# EAGLE design sid-guts-dx-rev005 (EAGLE 7.7.0)

## Sheet 1 of 3
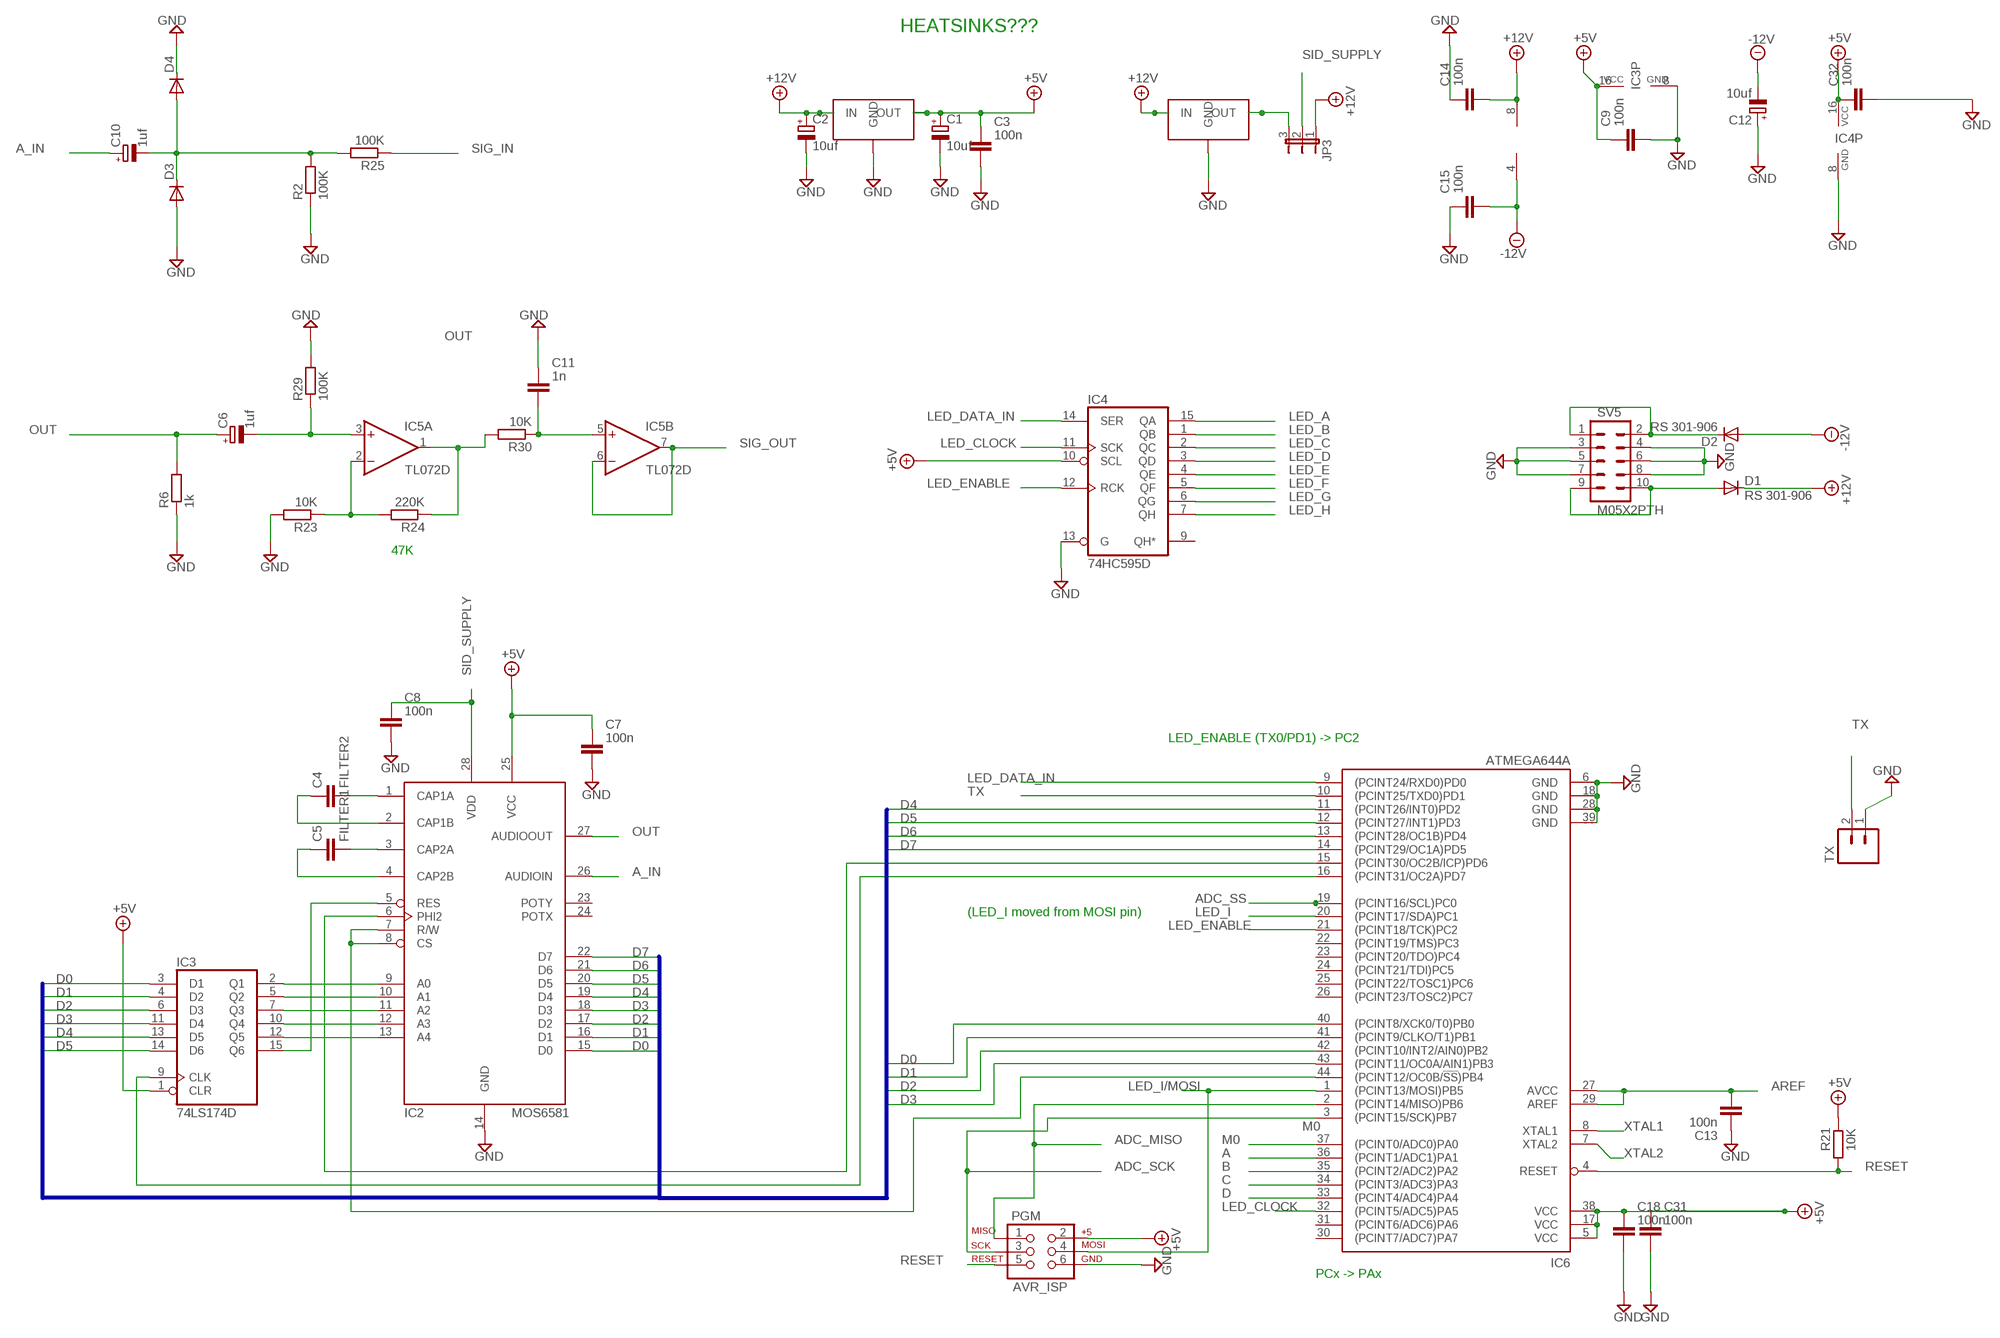
[diagram p0: schematic, sheet 1, part 1 of 2]
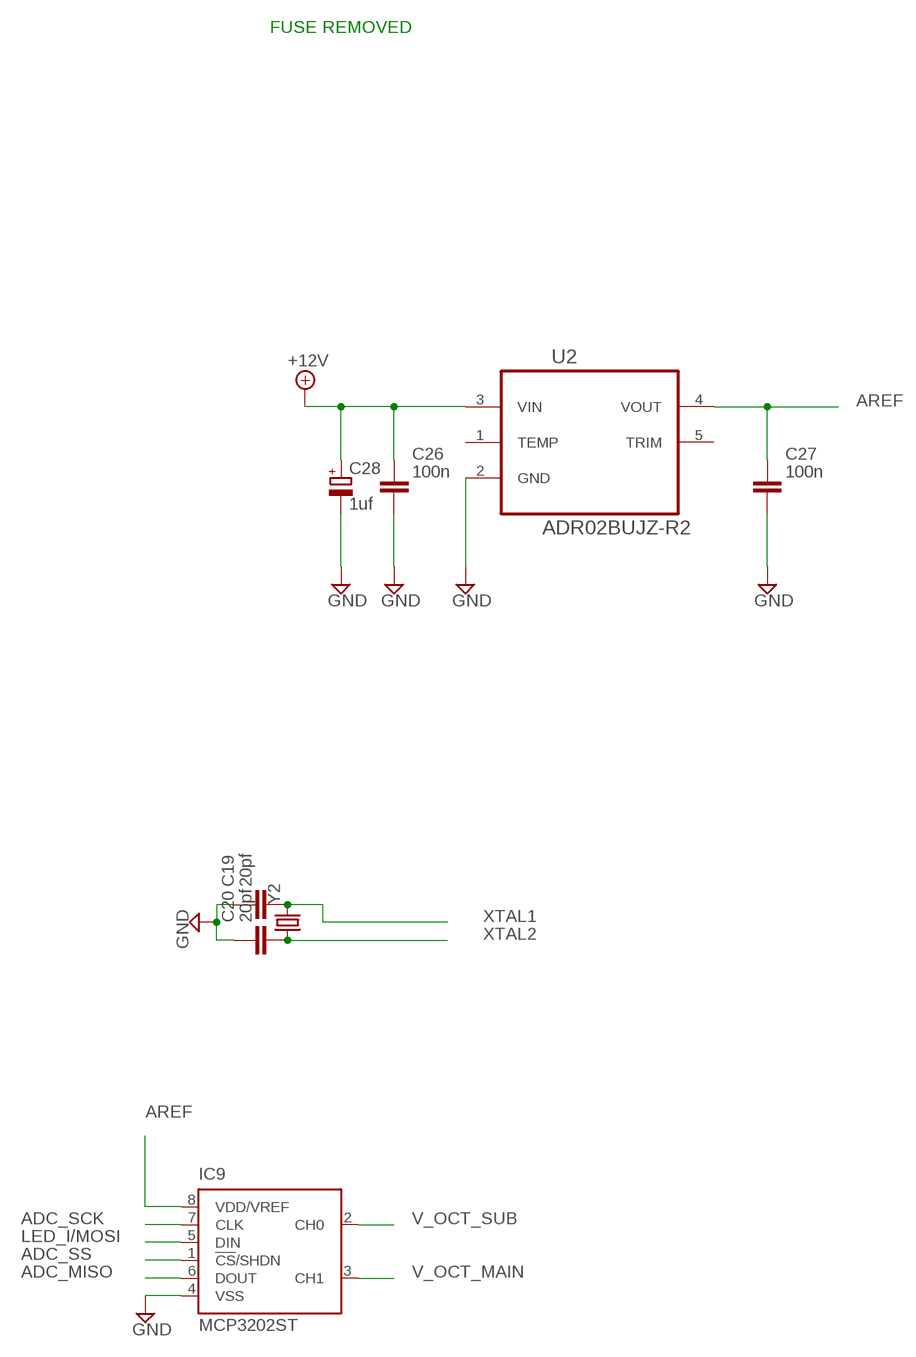
[diagram p1: schematic, sheet 1, part 2 of 2]

### Parts
C1  10uf  CPOL-EUB  [PANASONIC_B]
C2  10uf  CPOL-EUB  [PANASONIC_B]
C3  100n  CAPACITOR0603  [C0603]
C4  FILTER2  C-EU050-025X075  [C050-025X075]
C5  FILTER1  C-EU050-025X075  [C050-025X075]
C6  1uf  CPOL-EUB  [PANASONIC_B]
C7  100n  CAPACITOR0603  [C0603]
C8  100n  CAPACITOR0603  [C0603]
C9  100n  CAPACITOR0603  [C0603]
C10  1uf  CPOL-EUB  [PANASONIC_B]
C11  1n  CAPACITOR0603  [C0603]
C12  10uf  CPOL-EUB  [PANASONIC_B]
C13  100n  CAPACITOR0603  [C0603]
C14  100n  CAPACITOR0603  [C0603]
C15  100n  CAPACITOR0603  [C0603]
C18  100n  CAPACITOR0603  [C0603]
C19  20pf  CAPACITOR0603  [C0603]
C20  20pf  CAPACITOR0603  [C0603]
C26  100n  CAPACITOR0603  [C0603]
C27  100n  CAPACITOR0603  [C0603]
C28  1uf  CPOL-EUB  [PANASONIC_B]
C31  100n  CAPACITOR0603  [C0603]
C32  100n  CAPACITOR0603  [C0603]
D1  RS 301-906  DIODESMB  [SMB-DIODE]
D2  RS 301-906  DIODESMB  [SMB-DIODE]
D3  DIODE-SOD123  [SOD123]
D4  DIODE-SOD123  [SOD123]
IC2  MOS6581  [DIP-28]
IC3  74LS174D  [SO16]
IC4  74HC595D  [SO16]
IC5  TL072D  [SO08]
IC6  ATMEGA644A  [TQFP44]
IC9  MCP3202ST  [TSSOP8]
JP3  JP2E  [JP2]
PGM  AVR_ISP  AVR_SPI_PRG_6PTH  [2X3]
R2  100K  RESISTOR0603  [R0603]
R6  1k  RESISTOR0603  [R0603]
R21  10K  RESISTOR0603  [R0603]
R23  10K  RESISTOR0603  [R0603]
R24  220K  RESISTOR0603  [R0603]
R25  100K  RESISTOR0603  [R0603]
R29  100K  RESISTOR0603  [R0603]
R30  10K  RESISTOR0603  [R0603]
SV5  M05X2PTH  [AVR_ICSP]
TX  M02PTH  [1X02]
U2  ADR02BUJZ-R2  [SOT95P280X100-5N]
U3  7805  VREG-7805-DPAK2  [VREG-7805-DPAK2]
U4  7905  VREG-7805-DPAK2  [VREG-7805-DPAK2]
Y2  CRYSTALSMD  [HC49UP]

### Nets
+5V: C1.+ C3.1 C7.1 C9.1 C18.1 C31.1 C32.1 IC2.25(VCC) IC3.1(CLR) IC3.16(VCC) IC4.10(SCL) IC4.16(VCC) IC6.5(VCC) IC6.17(VCC) IC6.38(VCC) PGM.2 R21.2 U3.VOUT(OUT) ; also sheet 2,3
+12V: C2.+ C14.2 C26.1 C28.+ D1.C IC5.8(P:V+) JP3.1 U2.3(VIN) U3.VIN(IN) U4.VIN(IN) ; also sheet 2,3
-12V: C12.- C15.2 D2.A IC5.4(P:V-) ; also sheet 2,3
A: IC6.36((PCINT1/ADC1)PA1) ; also sheet 2
A_IN: C10.+ IC2.26(AUDIOIN)
ADC_MISO: IC6.2((PCINT14/MISO)PB6) IC9.6(DOUT) PGM.1
ADC_SCK: IC6.3((PCINT15/SCK)PB7) IC9.7(CLK) PGM.3
ADC_SS: IC6.19((PCINT16/SCL)PC0) IC9.1(!CS!/SHDN)
AREF: C13.2 C27.1 IC6.27(AVCC) IC6.29(AREF) IC9.8(VDD/VREF) U2.4(VOUT)
B: IC6.35((PCINT2/ADC2)PA2) ; also sheet 2
C: IC6.34((PCINT3/ADC3)PA3) ; also sheet 2
CS/RW: IC2.7(R/W) IC2.8(CS) IC6.44((PCINT12/OC0B/!SS!)PB4)
D: IC6.33((PCINT4/ADC4)PA4) ; also sheet 2
D0: IC2.15(D0) IC3.3(D1) IC6.40((PCINT8/XCK0/T0)PB0)
D1: IC2.16(D1) IC3.4(D2) IC6.41((PCINT9/CLKO/T1)PB1)
D2: IC2.17(D2) IC3.6(D3) IC6.42((PCINT10/INT2/AIN0)PB2)
D3: IC2.18(D3) IC3.11(D4) IC6.43((PCINT11/OC0A/AIN1)PB3)
D4: IC2.19(D4) IC3.13(D5) IC6.11((PCINT26/INT0)PD2)
D5: IC2.20(D5) IC3.14(D6) IC6.12((PCINT27/INT1)PD3)
D6: IC2.21(D6) IC6.13((PCINT28/OC1B)PD4)
D7: IC2.22(D7) IC6.14((PCINT29/OC1A)PD5)
GND: C1.- C2.- C3.2 C7.2 C8.2 C9.2 C11.1 C12.+ C13.1 C14.1 C15.1 C18.2 C19.1 C20.1 C26.2 C27.2 C28.- C31.2 C32.2 D3.A D4.C IC2.14(GND) IC3.8(GND) IC4.8(GND) IC4.13(G) IC6.6(GND) IC6.18(GND) IC6.28(GND) IC6.39(GND) IC9.4(VSS) PGM.6 R2.1 R6.1 R23.2 R29.2 SV5.3 SV5.4 SV5.5 SV5.6 SV5.7 SV5.8 TX.1 U2.2(GND) U3.GND U4.GND ; also sheet 2,3
LED_A: IC4.15(QA) ; also sheet 2
LED_B: IC4.1(QB) ; also sheet 2
LED_C: IC4.2(QC) ; also sheet 2
LED_CLOCK: IC4.11(SCK) IC6.32((PCINT5/ADC5)PA5)
LED_D: IC4.3(QD) ; also sheet 2
LED_DATA_IN: IC4.14(SER) IC6.9((PCINT24/RXD0)PD0)
LED_E: IC4.4(QE) ; also sheet 2
LED_ENABLE: IC4.12(RCK) IC6.21((PCINT18/TCK)PC2)
LED_F: IC4.5(QF) ; also sheet 2
LED_G: IC4.6(QG) ; also sheet 2
LED_H: IC4.7(QH) ; also sheet 2
LED_I: IC6.20((PCINT17/SDA)PC1) ; also sheet 2
LED_I/MOSI: IC6.1((PCINT13/MOSI)PB5) IC9.5(DIN) PGM.4
M0: IC6.37((PCINT0/ADC0)PA0) ; also sheet 2
N$1: D2.C SV5.1 SV5.2
N$2: JP3.3 U4.VOUT(OUT)
N$3: D1.A SV5.9 SV5.10
N$6: C4.2 IC2.1(CAP1A)
N$8: C4.1 IC2.2(CAP1B)
N$10: C5.2 IC2.3(CAP2A)
N$11: C5.1 IC2.4(CAP2B)
N$12: IC2.9(A0) IC3.2(Q1)
N$13: IC2.10(A1) IC3.5(Q2)
N$14: IC2.11(A2) IC3.7(Q3)
N$15: IC2.12(A3) IC3.10(Q4)
N$16: IC2.13(A4) IC3.12(Q5)
N$17: IC2.5(RES) IC3.15(Q6)
N$19: IC5.1(A:OUT) R24.1 R30.2
N$21: IC3.9(CLK) IC6.16((PCINT31/OC2A)PD7)
N$22: C6.- IC5.3(A:+IN) R29.1
N$23: IC5.2(A:-IN) R23.1 R24.2
N$24: IC2.6(PHI2) IC6.15((PCINT30/OC2B/ICP)PD6)
N$30: C10.- D3.C D4.A R2.2 R25.2
N$42: C11.2 IC5.5(B:+IN) R30.1
OUT: C6.+ IC2.27(AUDIOOUT) R6.2
RESET: IC6.4(RESET) PGM.5 R21.1
SID_SUPPLY: C8.1 IC2.28(VDD) JP3.2
SIG_IN: R25.1 ; also sheet 2
SIG_OUT: IC5.6(B:-IN) IC5.7(B:OUT) ; also sheet 2
TX: IC6.10((PCINT25/TXD0)PD1) TX.2
V_OCT_MAIN: IC9.3(CH1) ; also sheet 3
V_OCT_SUB: IC9.2(CH0) ; also sheet 3
XTAL1: C19.2 IC6.8(XTAL1) Y2.2
XTAL2: C20.2 IC6.7(XTAL2) Y2.1
Unconnected: IC2.23(POTY) IC2.24(POTX) IC4.9(QH*) IC6.22((PCINT19/TMS)PC3) IC6.23((PCINT20/TDO)PC4) IC6.24((PCINT21/TDI)PC5) IC6.25((PCINT22/TOSC1)PC6) IC6.26((PCINT23/TOSC2)PC7) IC6.30((PCINT7/ADC7)PA7) IC6.31((PCINT6/ADC6)PA6) U2.1(TEMP) U2.5(TRIM)

### Buses
D[0..7]

### Notes on the sheet
- HEATSINKS???
- FUSE REMOVED
- 47K
- LED_ENABLE (TX0/PD1) -> PC2
- (LED_I moved from MOSI pin)
- PCx -> PAx

## Sheet 2 of 3
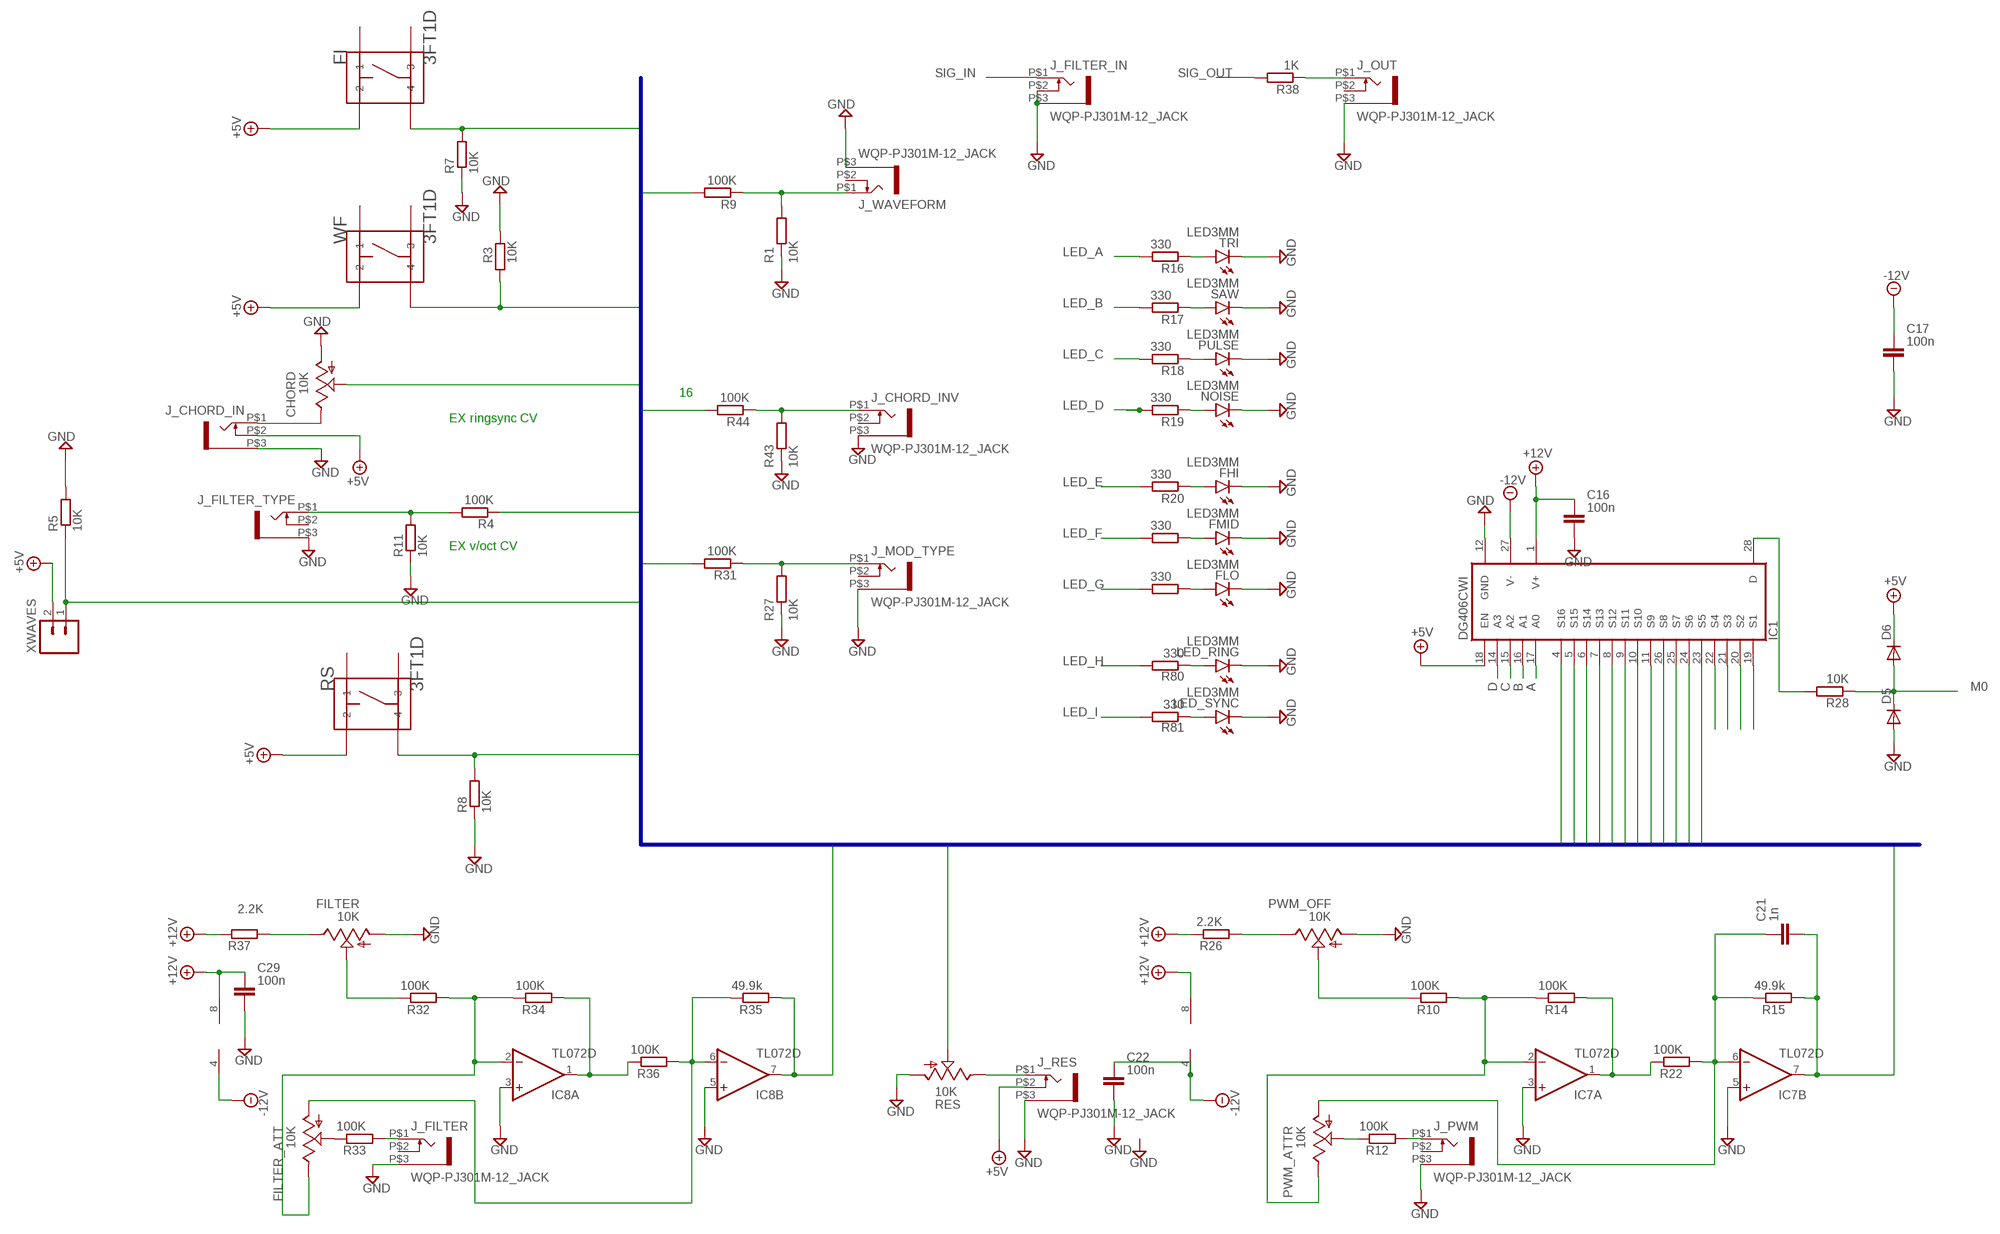
[diagram p2: schematic, sheet 2]

### Parts
C16  100n  CAPACITOR0603  [C0603]
C17  100n  CAPACITOR0603  [C0603]
C21  1n  CAPACITOR0603  [C0603]
C22  100n  CAPACITOR0603  [C0603]
C29  100n  CAPACITOR0603  [C0603]
CHORD  10K  ALPHA-9MMA  [EVUF]
D5  DIODE-SOD123  [SOD123]
D6  DIODE-SOD123  [SOD123]
FHI  LED3MM  [LED3MM]
FI  3FT1D  [3FT]
FILTER  10K  ALPHA-9MMA  [EVUF]
FILTER_ATT  10K  ALPHA-9MMA  [EVUF]
FLO  LED3MM  [LED3MM]
FMID  LED3MM  [LED3MM]
IC1  DG406CWI  [SO28L]
IC7  TL072D  [SO08]
IC8  TL072D  [SO08]
J_CHORD_IN  WQP-PJ301M-12_JACK  [WQP-PJ301M-12_JACK]
J_CHORD_INV  WQP-PJ301M-12_JACK  [WQP-PJ301M-12_JACK]
J_FILTER  WQP-PJ301M-12_JACK  [WQP-PJ301M-12_JACK]
J_FILTER_IN  WQP-PJ301M-12_JACK  [WQP-PJ301M-12_JACK]
J_FILTER_TYPE  WQP-PJ301M-12_JACK  [WQP-PJ301M-12_JACK]
J_MOD_TYPE  WQP-PJ301M-12_JACK  [WQP-PJ301M-12_JACK]
J_OUT  WQP-PJ301M-12_JACK  [WQP-PJ301M-12_JACK]
J_PWM  WQP-PJ301M-12_JACK  [WQP-PJ301M-12_JACK]
J_RES  WQP-PJ301M-12_JACK  [WQP-PJ301M-12_JACK]
J_WAVEFORM  WQP-PJ301M-12_JACK  [WQP-PJ301M-12_JACK]
LED_RING  LED3MM  [LED3MM]
LED_SYNC  LED3MM  [LED3MM]
NOISE  LED3MM  [LED3MM]
PULSE  LED3MM  [LED3MM]
PWM_ATTR  10K  ALPHA-9MMA  [EVUF]
PWM_OFF  10K  ALPHA-9MMA  [EVUF]
R1  10K  RESISTOR0603  [R0603]
R3  10K  RESISTOR0603  [R0603]
R4  100K  RESISTOR0603  [R0603]
R5  10K  RESISTOR0603  [R0603]
R7  10K  RESISTOR0603  [R0603]
R8  10K  RESISTOR0603  [R0603]
R9  100K  RESISTOR0603  [R0603]
R10  100K  RESISTOR0603  [R0603]
R11  10K  RESISTOR0603  [R0603]
R12  100K  RESISTOR0603  [R0603]
R14  100K  RESISTOR0603  [R0603]
R15  49.9k  RESISTOR0603  [R0603]
R16  330  RESISTOR0603  [R0603]
R17  330  RESISTOR0603  [R0603]
R18  330  RESISTOR0603  [R0603]
R19  330  RESISTOR0603  [R0603]
R20  330  RESISTOR0603  [R0603]
R22  100K  RESISTOR0603  [R0603]
R26  2.2K  RESISTOR0603  [R0603]
R27  10K  RESISTOR0603  [R0603]
R28  10K  RESISTOR0603  [R0603]
R31  100K  RESISTOR0603  [R0603]
R32  100K  RESISTOR0603  [R0603]
R33  100K  RESISTOR0603  [R0603]
R34  100K  RESISTOR0603  [R0603]
R35  49.9k  RESISTOR0603  [R0603]
R36  100K  RESISTOR0603  [R0603]
R37  2.2K  RESISTOR0603  [R0603]
R38  1K  RESISTOR0603  [R0603]
R43  10K  RESISTOR0603  [R0603]
R44  100K  RESISTOR0603  [R0603]
R80  330  RESISTOR0603  [R0603]
R81  330  RESISTOR0603  [R0603]
R82  330  RESISTOR0603  [R0603]
R83  330  RESISTOR0603  [R0603]
RES  10K  ALPHA-9MMA  [EVUF]
RS  3FT1D  [3FT]
SAW  LED3MM  [LED3MM]
TRI  LED3MM  [LED3MM]
WF  3FT1D  [3FT]
XWAVES  M02PTH  [1X02]

### Nets
+5V: D6.C FI.P$2 IC1.18(EN) J_CHORD_IN.P$2 J_RES.P$2 RS.P$2 WF.P$2 XWAVES.2 ; also sheet 1,3
+12V: C16.1 C29.1 IC1.1(V+) IC7.8(P:V+) IC8.8(P:V+) R26.2 R37.2 ; also sheet 1,3
-12V: C17.1 C22.1 IC1.27(V-) IC7.4(P:V-) IC8.4(P:V-) ; also sheet 1,3
A: IC1.17(A0) ; also sheet 1
B: IC1.16(A1) ; also sheet 1
C: IC1.15(A2) ; also sheet 1
D: IC1.14(A3) ; also sheet 1
EXP1: IC1.22(S4)
EXP3: IC1.20(S2)
EXP5: IC1.21(S3)
EXP6: IC1.19(S1)
GND: C16.2 C17.2 C22.2 C29.2 CHORD.1(A) D5.A FHI.K(C) FILTER.1(A) FLO.K(C) FMID.K(C) IC1.12(GND) IC7.3(A:+IN) IC7.5(B:+IN) IC8.3(A:+IN) IC8.5(B:+IN) J_CHORD_IN.P$3 J_CHORD_INV.P$3 J_FILTER.P$3 J_FILTER_IN.P$2 J_FILTER_IN.P$3 J_FILTER_TYPE.P$3 J_MOD_TYPE.P$3 J_OUT.P$3 J_PWM.P$3 J_RES.P$3 J_WAVEFORM.P$3 LED_RING.K(C) LED_SYNC.K(C) NOISE.K(C) PULSE.K(C) PWM_OFF.1(A) R1.1 R3.2 R5.2 R7.1 R8.1 R11.1 R27.1 R43.1 RES.1(A) SAW.K(C) TRI.K(C) ; also sheet 1,3
I5: C21.2 IC1.23(S5) IC7.7(B:OUT) R15.1
I6: IC1.24(S6) RES.2(S)
I7: IC1.25(S7) IC8.7(B:OUT) R35.1
I8: FI.P$4 IC1.26(S8) R7.2
I9: IC1.11(S9) R5.1 XWAVES.1
I10: IC1.10(S10) R8.2 RS.P$4
I11: IC1.9(S11) R4.1
I12: CHORD.2(S) IC1.8(S12)
I13: IC1.7(S13) R9.2
I14: IC1.6(S14) R3.1 WF.P$4
I15: IC1.5(S15) R31.2
I16: IC1.4(S16) R44.2
LED_A: R16.2 ; also sheet 1
LED_B: R17.2 ; also sheet 1
LED_C: R18.2 ; also sheet 1
LED_D: R19.2 ; also sheet 1
LED_E: R20.2 ; also sheet 1
LED_F: R83.2 ; also sheet 1
LED_G: R82.2 ; also sheet 1
LED_H: R80.2 ; also sheet 1
LED_I: R81.2 ; also sheet 1
M0: D5.C D6.A R28.1 ; also sheet 1
N$18: FHI.A R20.1
N$20: CHORD.3(E) J_CHORD_IN.P$1
N$25: FMID.A R83.1
N$26: FLO.A R82.1
N$27: IC1.28(D) R28.2
N$28: J_WAVEFORM.P$1 R1.2 R9.1
N$29: LED_RING.A R80.1
N$31: LED_SYNC.A R81.1
N$33: J_FILTER_TYPE.P$1 R4.2 R11.2
N$34: J_RES.P$1 RES.3(E)
N$35: PWM_OFF.2(S) R10.2
N$36: IC7.2(A:-IN) PWM_ATTR.3(E) R10.1 R14.2
N$37: R16.1 TRI.A
N$38: R17.1 SAW.A
N$39: PULSE.A R18.1
N$40: NOISE.A R19.1
N$41: J_PWM.P$1 R12.1
N$43: PWM_ATTR.2(S) R12.2
N$44: IC7.1(A:OUT) R14.1 R22.2
N$45: C21.1 IC7.6(B:-IN) PWM_ATTR.1(A) R15.2 R22.1
N$46: PWM_OFF.3(E) R26.1
N$47: J_MOD_TYPE.P$1 R27.2 R31.1
N$48: FILTER.2(S) R32.2
N$49: FILTER_ATT.3(E) IC8.2(A:-IN) R32.1 R34.2
N$50: J_FILTER.P$1 R33.1
N$51: IC8.1(A:OUT) R34.1 R36.2
N$52: FILTER_ATT.1(A) IC8.6(B:-IN) R35.2 R36.1
N$53: FILTER.3(E) R37.1
N$54: J_OUT.P$1 R38.1
N$55: FILTER_ATT.2(S) R33.2
N$60: J_CHORD_INV.P$1 R43.2 R44.1
SIG_IN: J_FILTER_IN.P$1 ; also sheet 1
SIG_OUT: R38.2 ; also sheet 1
Unconnected: FI.P$1 FI.P$3 J_CHORD_INV.P$2 J_FILTER.P$2 J_FILTER_TYPE.P$2 J_MOD_TYPE.P$2 J_OUT.P$2 J_PWM.P$2 J_WAVEFORM.P$2 RS.P$1 RS.P$3 WF.P$1 WF.P$3

### Buses
I[1..16]

### Notes on the sheet
- 16
- EX ringsync CV
- EX v/oct CV

## Sheet 3 of 3
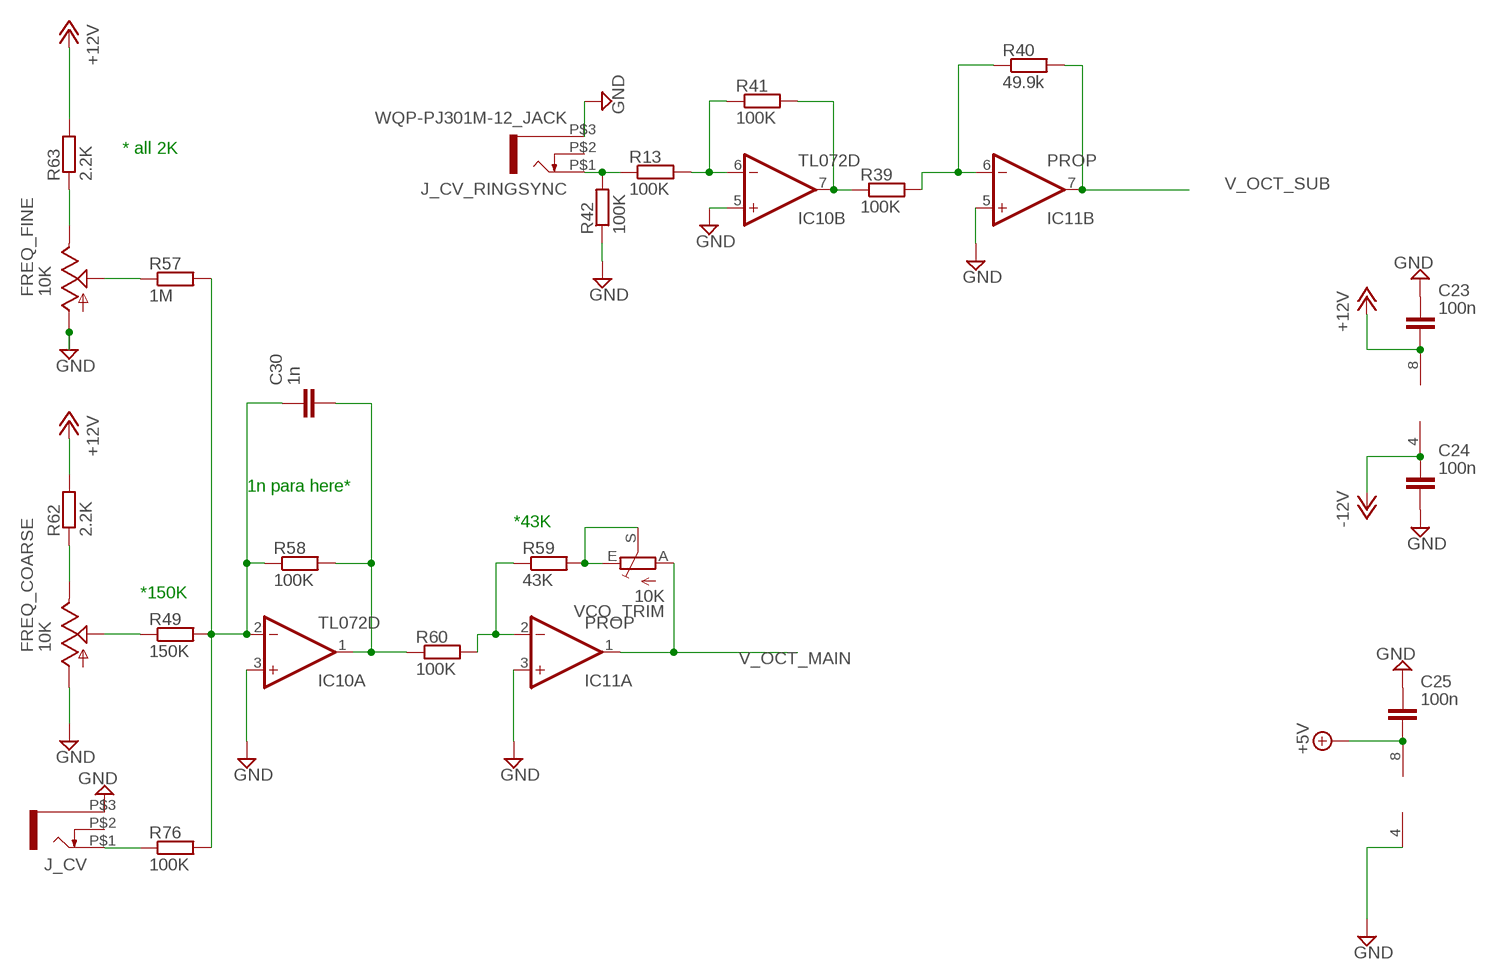
[diagram p3: schematic, sheet 3]

### Parts
C23  100n  CAPACITOR0603  [C0603]
C24  100n  CAPACITOR0603  [C0603]
C25  100n  CAPACITOR0603  [C0603]
C30  1n  CAPACITOR0603  [C0603]
FREQ_COARSE  10K  ALPHA-9MMA  [EVUF]
FREQ_FINE  10K  ALPHA-9MMA  [EVUF]
IC10  TL072D  [SO08]
IC11  PROP  TL072D  [SO08]
J_CV  WQP-PJ301M-12_JACK  [WQP-PJ301M-12_JACK]
J_CV_RINGSYNC  WQP-PJ301M-12_JACK  [WQP-PJ301M-12_JACK]
R13  100K  RESISTOR0603  [R0603]
R39  100K  RESISTOR0603  [R0603]
R40  49.9k  RESISTOR0603  [R0603]
R41  100K  RESISTOR0603  [R0603]
R42  100K  RESISTOR0603  [R0603]
R49  150K  RESISTOR0603  [R0603]
R57  1M  RESISTOR0603  [R0603]
R58  100K  RESISTOR0603  [R0603]
R59  43K  RESISTOR0603  [R0603]
R60  100K  RESISTOR0603  [R0603]
R62  2.2K  RESISTOR0603  [R0603]
R63  2.2K  RESISTOR0603  [R0603]
R76  100K  RESISTOR0603  [R0603]
VCO_TRIM  10K  TRIM_1234-S64YW  [S64YW]

### Nets
+5V: C25.2 IC11.8(P:V+) ; also sheet 1,2
+12V: C23.2 IC10.8(P:V+) R62.2 R63.2 ; also sheet 1,2
-12V: C24.1 IC10.4(P:V-) ; also sheet 1,2
GND: C23.1 C24.2 C25.1 FREQ_COARSE.1(A) FREQ_FINE.1(A) IC10.3(A:+IN) IC10.5(B:+IN) IC11.3(A:+IN) IC11.4(P:V-) IC11.5(B:+IN) J_CV.P$3 J_CV_RINGSYNC.P$3 R42.1 ; also sheet 1,2
N$4: IC10.7(B:OUT) R39.1 R41.2
N$5: IC10.6(B:-IN) R13.2 R41.1
N$7: J_CV_RINGSYNC.P$1 R13.1 R42.2
N$9: IC11.6(B:-IN) R39.2 R40.1
N$32: J_CV.P$1 R76.1
N$79: FREQ_COARSE.2(S) R49.1
N$80: C30.1 IC10.2(A:-IN) R49.2 R57.2 R58.1 R76.2
N$82: FREQ_FINE.2(S) R57.1
N$83: C30.2 IC10.1(A:OUT) R58.2 R60.1
N$84: IC11.2(A:-IN) R59.1 R60.2
N$85: R59.2 VCO_TRIM.E VCO_TRIM.S
N$87: FREQ_COARSE.3(E) R62.1
N$88: FREQ_FINE.3(E) R63.1
V_OCT_MAIN: IC11.1(A:OUT) VCO_TRIM.A ; also sheet 1
V_OCT_SUB: IC11.7(B:OUT) R40.2 ; also sheet 1
Unconnected: J_CV.P$2 J_CV_RINGSYNC.P$2 VCO_TRIM.S@1(S)

### Notes on the sheet
- * all 2K
- 1n para here*
- *43K
- *150K

## Library data of the parts
C1 C2 C6 C10 C12 C28 = rcl:CPOL-EU: POLARIZED CAPACITOR, European symbol
C3 C7-C9 C11 C13-C27 C29-C32 = allum_extras:CAPACITOR
C4 C5 = rcl:C-EU: CAPACITOR, European symbol
CHORD FILTER FILTER_ATT FREQ_COARSE FREQ_FINE PWM_ATTR PWM_OFF RES = TomW:ALPHA-9MM: 9 mm Square Rotary Potentiometers Source: Panasonic
D1 D2 = SparkFun:DIODE: Diode These are standard reverse protection diodes and small signal diodes. SMA package can handle up to about 1A. SOD-323 can handle about 200mA. What the SOD-323 package when ordering, there are some mfgs out there that are 5-pin packages.
D3-D6 = diode:DIODE-: DIODE
FHI FLO FMID LED_RING LED_SYNC NOISE PULSE SAW TRI = allum_extras:LED
FI RS WF = mec switches:3FT1D: Mulitmec - 3FT1D <http://www.mec.dk/statisk.php4?id=504> Switch 3F - Through Hole with basic matt cover http://www.mec.dk
IC1 = maxim:DG406CWI: ANALOG MULTIPLEXER; MF: MAXIM; MPN: DG406CWI; OC_FARNELL: unknown; OC_NEWARK: 77C6458
IC2 = 65xxx:MOS6581
IC3 = 74xx-eu:74*174: Hex D type FLIP FLOP, clear
IC4 = 74xx-eu:74*595: 8-bit SHIFT REGISTER, output latch
IC5 IC7 IC8 = TomW:TL072: OP AMP
IC6 = atmel:ATMEGA644: 8-bit Microcontroller with 64K Bytes In-System Programmable Flash Source: http://www.atmel.com/dyn/resources/prod_documents/doc2593.pdf; MPN: ATMEGA644PV-10AU; OC_FARNELL: 1455123; OC_NEWARK: 58M3748
IC9 = microchip:MCP3202: 2.7V Dual Channel 12-Bit A/D Converter with SPI Serial Interface Source: http://ww1.microchip.com/downloads/en/DeviceDoc/21034D.pdf; MF: MICROCHIP; MPN: MCP3202-CI/ST; OC_FARNELL: unknown; OC_NEWARK: 59K0226
IC10 IC11 = linear:TL072: OP AMP
J_CHORD_IN J_CHORD_INV J_CV J_CV_RINGSYNC J_FILTER J_FILTER_IN J_FILTER_TYPE J_MOD_TYPE J_OUT J_PWM J_RES J_WAVEFORM = allum_extras:WQP-PJ301M-12_JACK
JP3 = allum_extras:JP2E: JUMPER
PGM = SparkFun:AVR_SPI_PRG_6: AVR ISP 6 Pin This is the reduced ISP connector for AVR programming. Common on Arduino. This footprint will take up less PCB space and can be used with a 10-pin to 6-pin adapter such as SKU: BOB-08508
R1-R44 R49 R57-R60 R62 R63 R76 R80-R83 = allum_extras:RESISTOR
SV5 = SparkFun:M05X2: Header 5x2 Standard 10-pin dual row 0.1" header. Commonly used with AVR-ISP. Use with Spark Fun Electronics SKU: PRT-00778
TX XWAVES = SparkFun:M02: Header 2 Standard 2-pin 0.1" header. Use with straight break away headers (SKU : PRT-00116), right angle break away headers (PRT-00553), swiss pins (PRT-00743), machine pins (PRT-00117), and female headers (PRT-00115). Molex polarized connector foot print use with SKU : PRT-08233 with associated crimp pins and housings.
U2 = allum_extras:ADR02BUJZ-R2: Ultracompact, Precision 10.0 V/5.0 V/2.5 V/3.0 V Voltage References; MPN: ADR02BUJZ-R2; OC_FARNELL: 1699545; OC_NEWARK: 28M3867; PACKAGE: TSOT-5; SUPPLIER: Analog Devices
U3 U4 = vreg-7805-dpak2:VREG-7805-DPAK2
VCO_TRIM = pot:TRIM_1234-: POTENTIOMETER
Y2 = SparkFun:CRYSTAL: Crystals Various standard crystals. Proven footprints. Spark Fun Electronics SKU : COM-00534

## Board
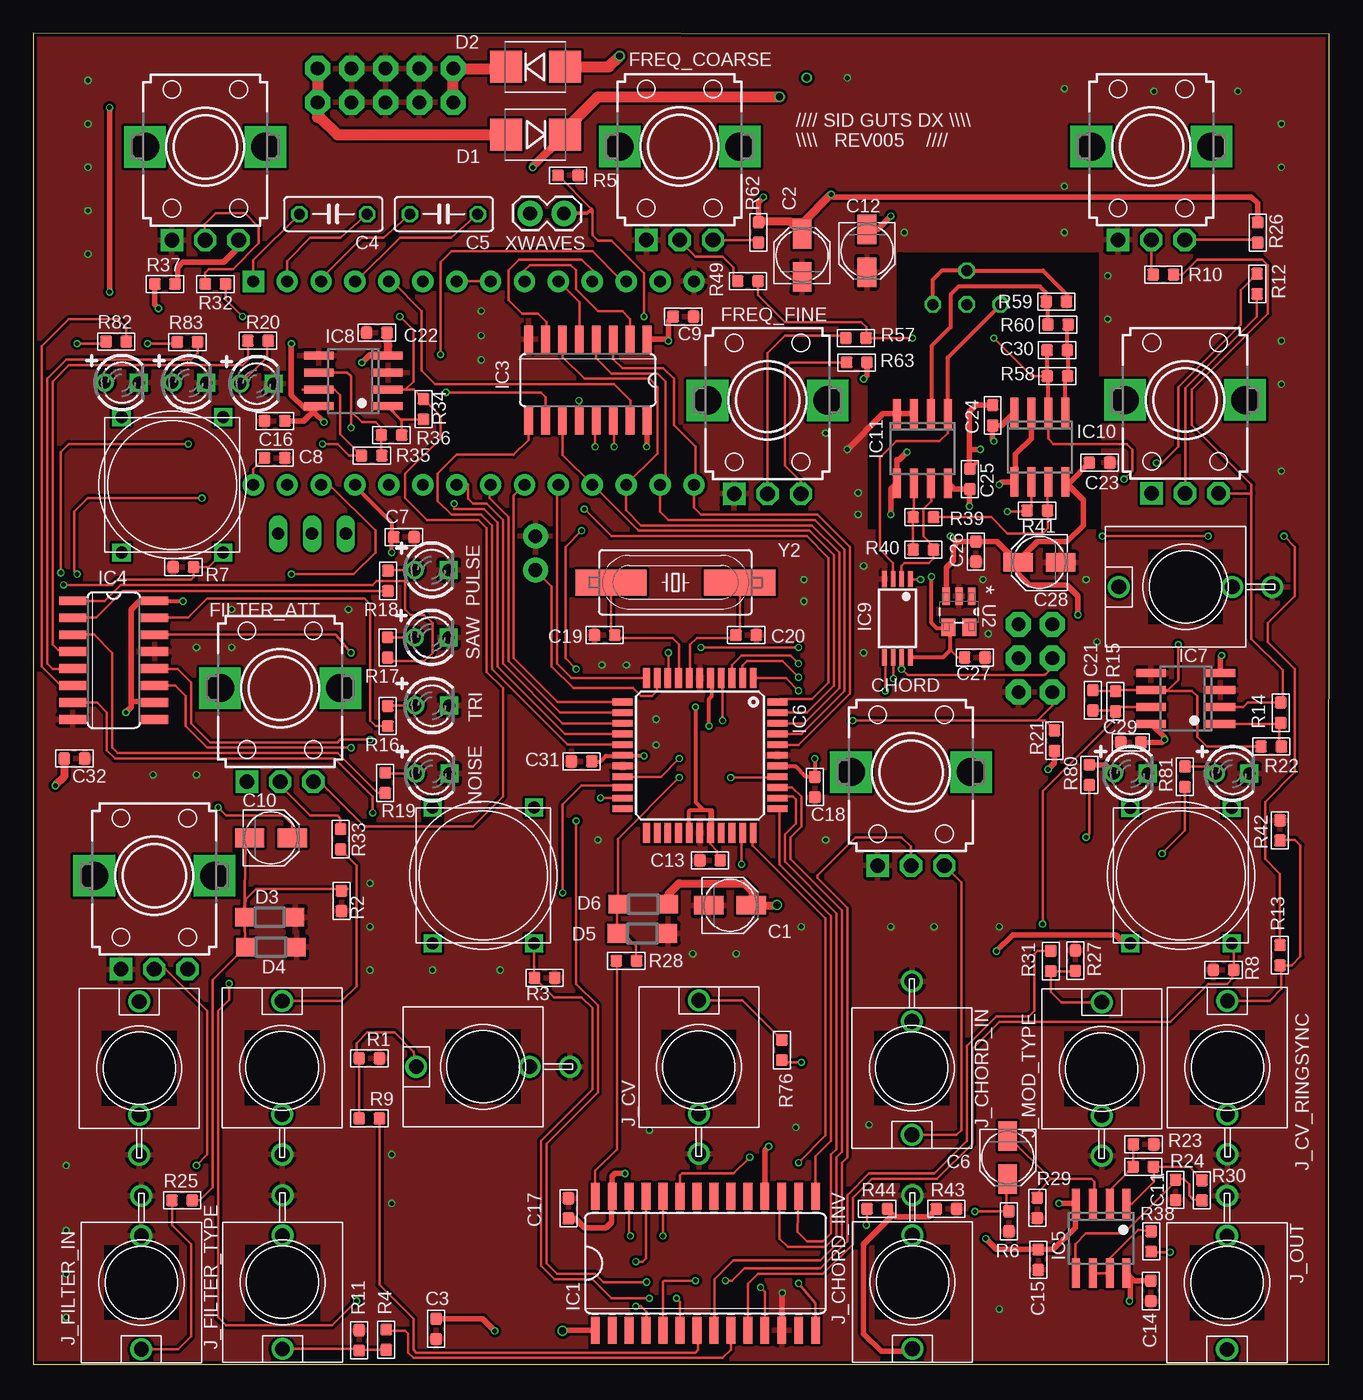
[diagram p4: board, top side]
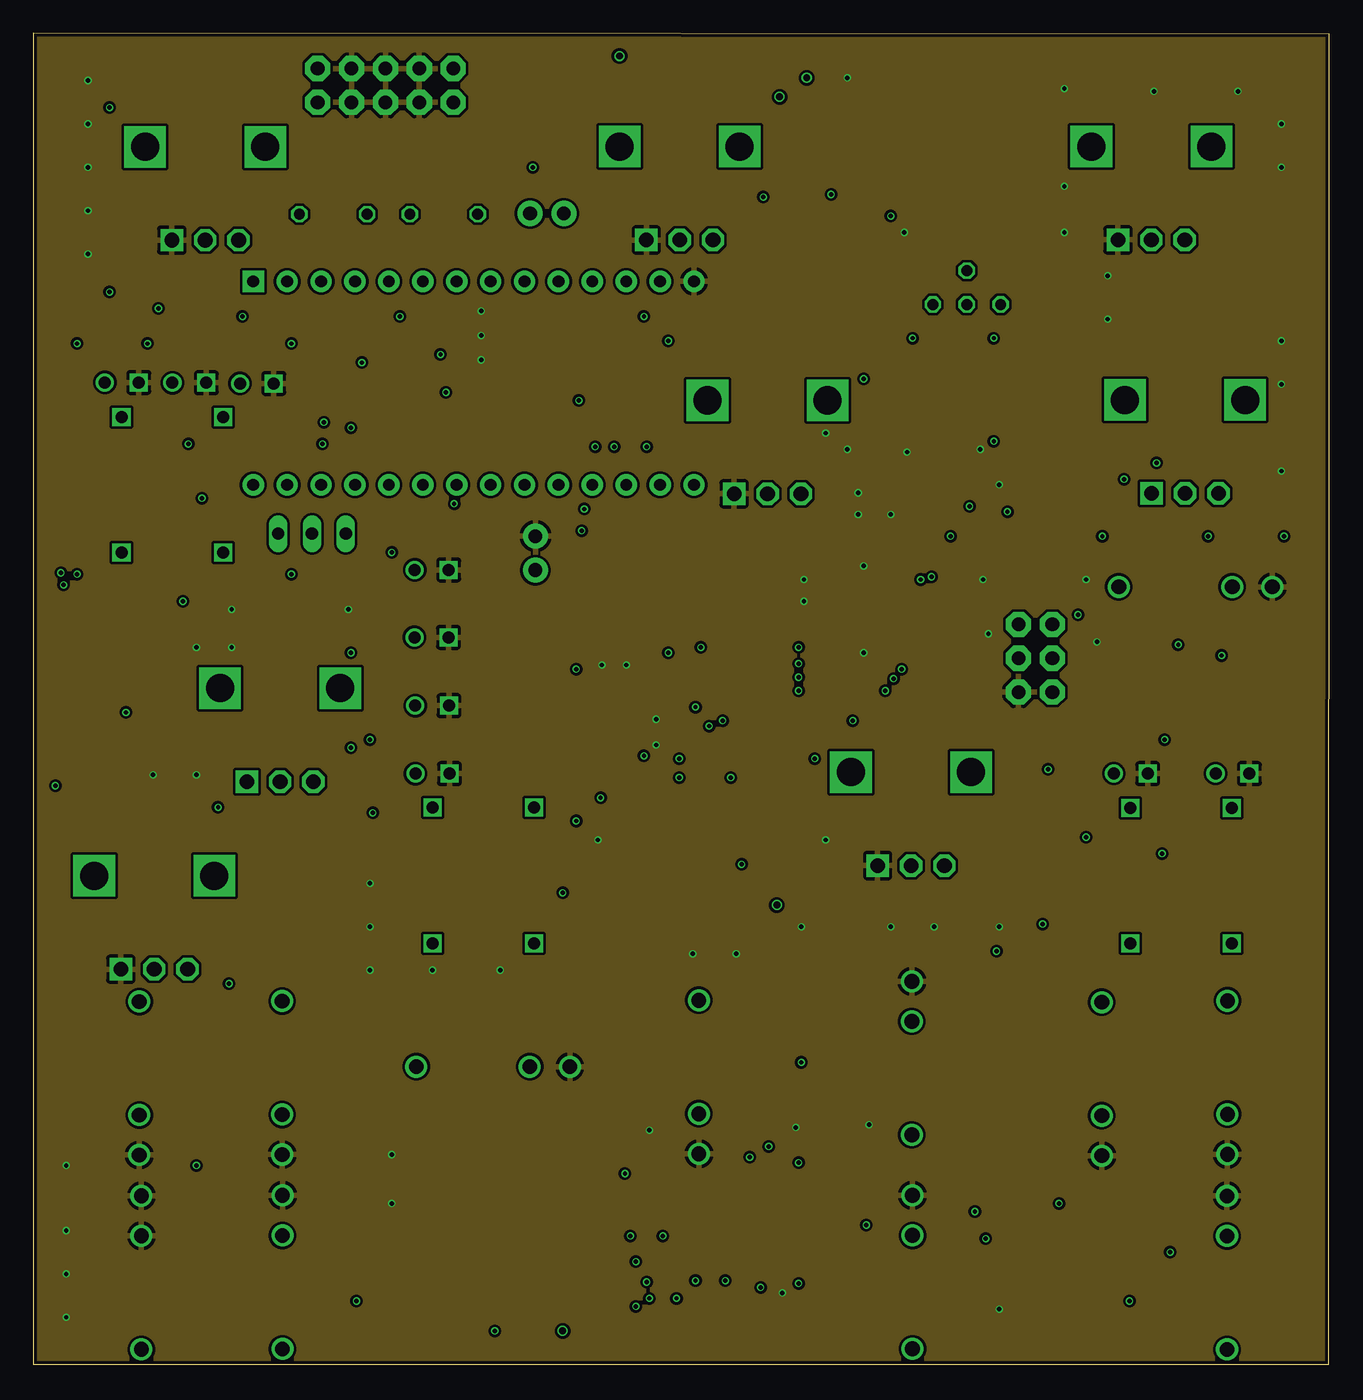
[diagram p5: board, inner layer Route2]
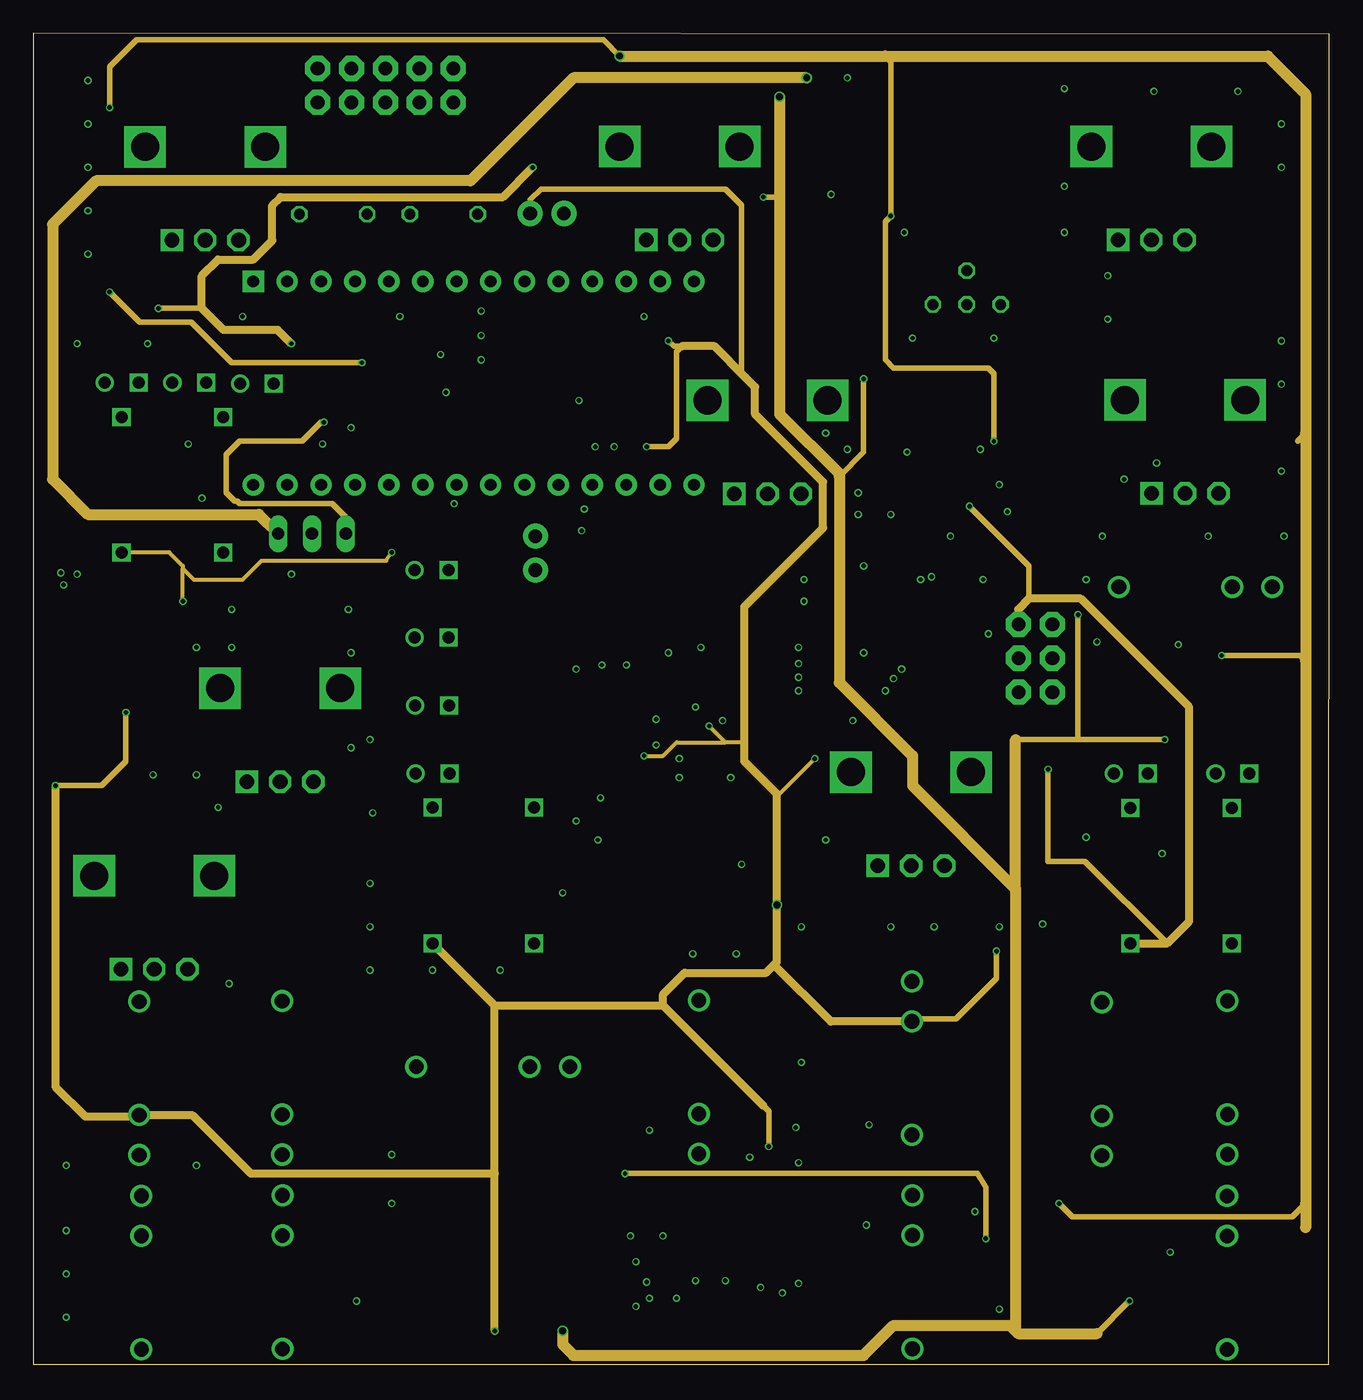
[diagram p6: board, inner layer POWER]
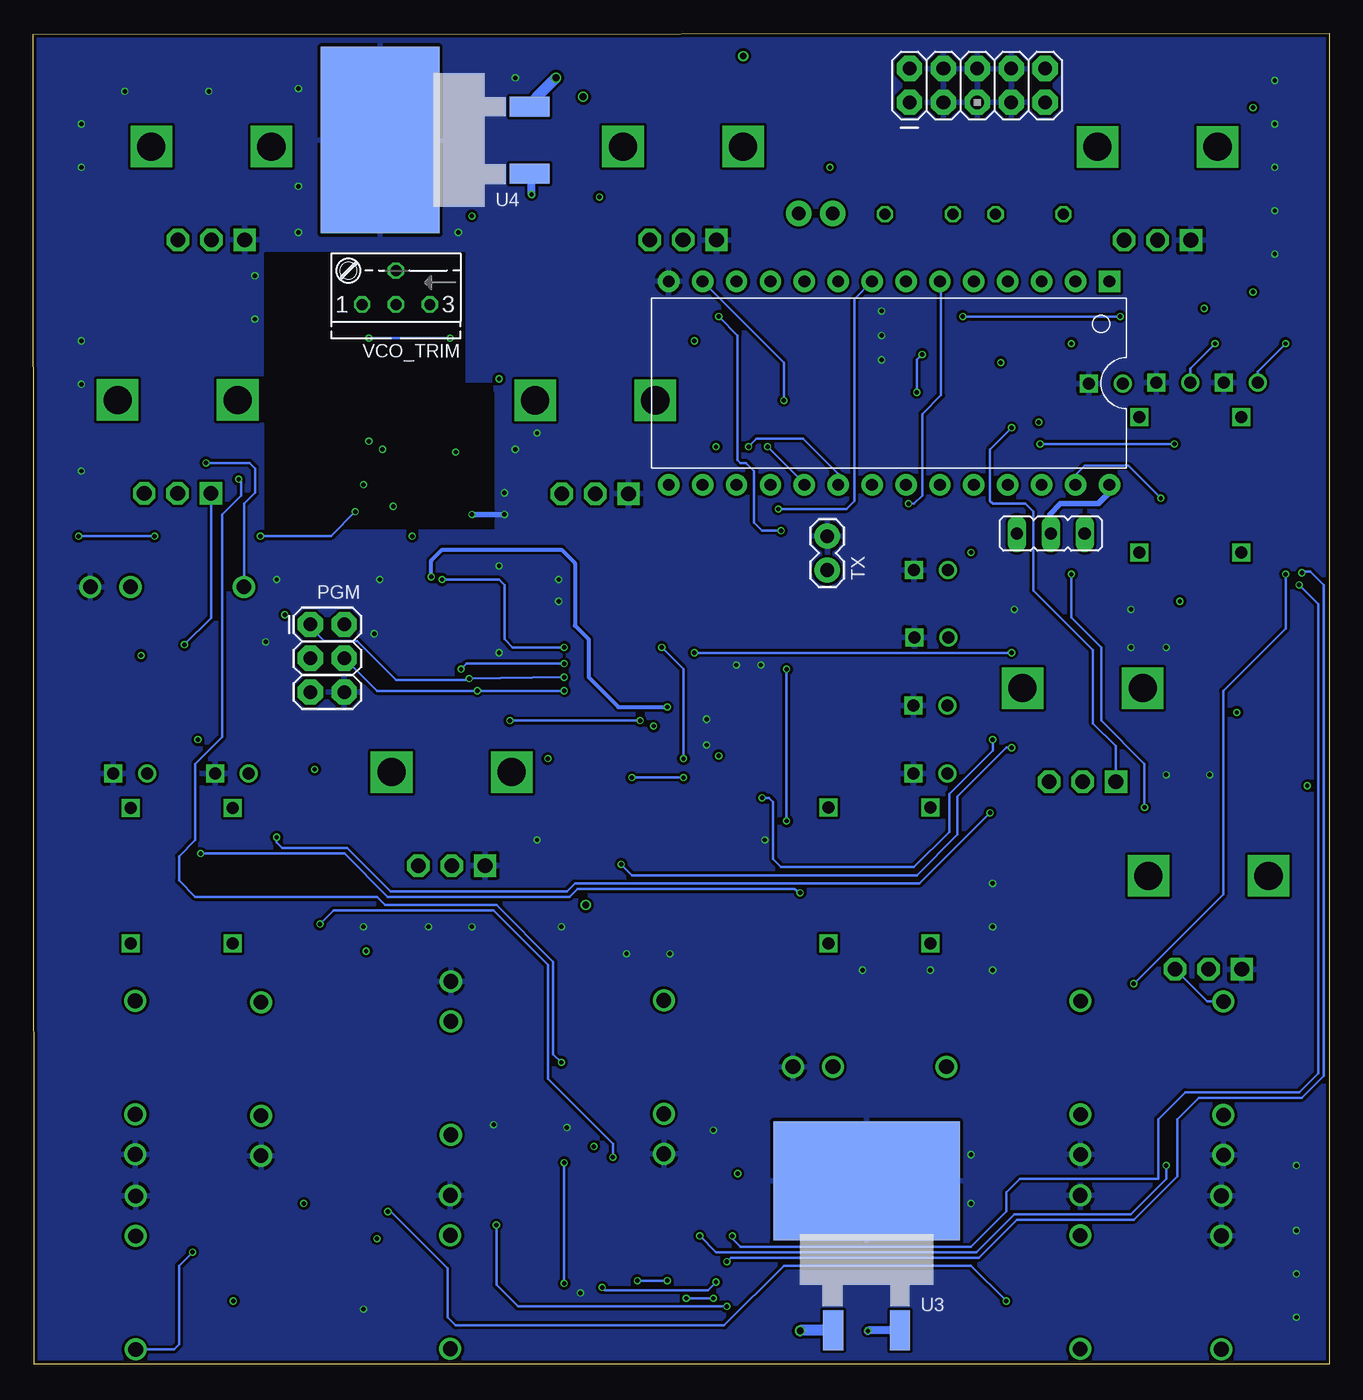
[diagram p7: board, bottom side, seen from below]

Size 97.09 x 99.7 mm. Coordinates in mm from the lower left corner, seen from the top.
Outline: 0,0 97.04,0 97.09,99.64 0,99.69 0,0
Copper layers (1*2*15*16): Top 0.035mm / dielectric 0.2mm / Route2 0.0175mm / dielectric 0.3mm / POWER 0.0175mm / dielectric 0.2mm / Bottom 0.035mm
Design rules "SeeedStudio_4layer_DRU_no_angle_20140221": minimum track width 8mil, minimum drill 12mil, track to track 8mil, track to pad 8mil, pad to pad 8mil, via to via 8mil, smd to smd 0mil, copper to edge 10mil, drill to drill 8mil, minimum pad ring 6mil, minimum via ring 4mil, stop-mask expansion 4mil, vias tented up to drill 100mil, thermal gap 10mil

### Footprints (pad centres in the part's own frame; a part is rotated, then mirrored left to right if it is on the bottom)
PANASONIC_B = smd 2.2 x 1.4: + 1.6,0; - -1.6,0
C0603 = smd 0.889 x 0.889: 1 -0.762,0; 2 0.762,0
C050-025X075 = drill 0.813 octagon: 1 -2.54,0; 2 2.54,0
EVUF = drill 1.1 pad 1.676 square: 1 -2.5,-7 | drill 1.1 pad 1.676 octagon: 2 0,-7; 3 2.5,-7 | drill 2.1 pad 2.8 square: M1 4.5,0; M2 -4.5,0
SMB-DIODE = smd 2.4 x 2.4: A 2.2,0; C -2.2,0
SOD123 = smd 1.4 x 1.4: A 1.9,0; C -1.9,0
LED3MM = drill 0.9: A -1.27,0 | drill 0.9 square: K 1.27,0
3FT = drill 0.9 square: P$1 5.08,3.81; P$2 -5.08,3.81; P$3 5.08,-3.81; P$4 -5.08,-3.81
SO28L = smd 0.66 x 2.032: 1 -8.255,-5.029; 2 -6.985,-5.029; 3 -5.715,-5.029; 4 -4.445,-5.029; 5 -3.175,-5.029; 6 -1.905,-5.029; 7 -0.635,-5.029; 8 0.635,-5.029; 9 1.905,-5.029; 10 3.175,-5.029; 11 4.445,-5.029; 12 5.715,-5.029; 13 6.985,-5.029; 14 8.255,-5.029; 15 8.255,5.029; 16 6.985,5.029; 17 5.715,5.029; 18 4.445,5.029; 19 3.175,5.029; 20 1.905,5.029; 21 0.635,5.029; 22 -0.635,5.029; 23 -1.905,5.029; 24 -3.175,5.029; 25 -4.445,5.029; 26 -5.715,5.029; 27 -6.985,5.029; 28 -8.255,5.029
DIP-28 = drill 0.889 pad 1.6 square: 1 -15.24,-7.62 | drill 0.889 pad 1.6: 2 -12.7,-7.62; 3 -10.16,-7.62; 4 -7.62,-7.62; 5 -5.08,-7.62; 6 -2.54,-7.62; 7 0,-7.62; 8 2.54,-7.62; 9 5.08,-7.62; 10 7.62,-7.62; 11 10.16,-7.62; 12 12.7,-7.62; 13 15.24,-7.62; 14 17.78,-7.62; 15 17.78,7.62; 16 15.24,7.62; 17 12.7,7.62; 18 10.16,7.62; 19 7.62,7.62; 20 5.08,7.62; 21 2.54,7.62; 22 0,7.62; 23 -2.54,7.62; 24 -5.08,7.62; 25 -7.62,7.62; 26 -10.16,7.62; 27 -12.7,7.62; 28 -15.24,7.62
SO16 = smd 0.66 x 2.032: 1 -4.445,-3.073; 2 -3.175,-3.073; 3 -1.905,-3.073; 4 -0.635,-3.073; 5 0.635,-3.073; 6 1.905,-3.073; 7 3.175,-3.073; 8 4.445,-3.073; 9 4.445,3.073; 10 3.175,3.073; 11 1.905,3.073; 12 0.635,3.073; 13 -0.635,3.073; 14 -1.905,3.073; 15 -3.175,3.073; 16 -4.445,3.073
SO08 = smd 0.6 x 2.2: 1 -1.905,-2.6; 2 -0.635,-2.6; 3 0.635,-2.6; 4 1.905,-2.6; 5 1.905,2.6; 6 0.635,2.6; 7 -0.635,2.6; 8 -1.905,2.6
TQFP44 = smd 1.5 x 0.5: 1 -5.8,4; 2 -5.8,3.2; 3 -5.8,2.4; 4 -5.8,1.6; 5 -5.8,0.8; 6 -5.8,0; 7 -5.8,-0.8; 8 -5.8,-1.6; 9 -5.8,-2.4; 10 -5.8,-3.2; 11 -5.8,-4; 23 5.8,-4; 24 5.8,-3.2; 25 5.8,-2.4; 26 5.8,-1.6; 27 5.8,-0.8; 28 5.8,0; 29 5.8,0.8; 30 5.8,1.6; 31 5.8,2.4; 32 5.8,3.2; 33 5.8,4 | smd 0.5 x 1.5: 12 -4,-5.8; 13 -3.2,-5.8; 14 -2.4,-5.8; 15 -1.6,-5.8; 16 -0.8,-5.8; 17 0,-5.8; 18 0.8,-5.8; 19 1.6,-5.8; 20 2.4,-5.8; 21 3.2,-5.8; 22 4,-5.8; 34 4,5.8; 35 3.2,5.8; 36 2.4,5.8; 37 1.6,5.8; 38 0.8,5.8; 39 0,5.8; 40 -0.8,5.8; 41 -1.6,5.8; 42 -2.4,5.8; 43 -3.2,5.8; 44 -4,5.8
TSSOP8 = smd 0.35 x 1.2: 1 -0.975,-2.925; 2 -0.325,-2.925; 3 0.325,-2.925; 4 0.975,-2.925; 5 0.975,2.925; 6 0.325,2.925; 7 -0.325,2.925; 8 -0.975,2.925
WQP-PJ301M-12_JACK = drill 1.1: P$1 0,5; P$2 0,-3.5; P$3 0,-6.5
JP2 = drill 0.914 long: 1 -2.54,0; 2 0,0; 3 2.54,0
2X3 = drill 1.016 pad 1.88 octagon: 1 0,0; 2 0,2.54; 3 2.54,0; 4 2.54,2.54; 5 5.08,0; 6 5.08,2.54
R0603 = smd 0.889 x 0.889: 1 -0.762,0; 2 0.762,0
AVR_ICSP = drill 1.016 pad 1.88 octagon: 1 -1.27,5.08; 2 1.27,5.08; 3 -1.27,2.54; 4 1.27,2.54; 5 -1.27,0; 6 1.27,0; 7 -1.27,-2.54; 8 1.27,-2.54; 9 -1.27,-5.08; 10 1.27,-5.08
1X02 = drill 1.016 pad 1.88: 1 0,0; 2 2.54,0
SOT95P280X100-5N = smd 1.321 x 0.559: 1 -1.168,0.94; 2 -1.168,0; 3 -1.168,-0.94 | smd 1.321 x 1.067: 4 1.168,-0.787; 5 1.168,0.787
VREG-7805-DPAK2 = smd 13.97 x 8.89: GND 0,8.7 | smd 1.5 x 3: VIN -2.5,-2.5; VOUT 2.5,-2.5
S64YW = drill 0.813 octagon: A 2.54,1.27; E -2.54,1.27; S 0,-1.27; S@1 0,1.27
HC49UP = smd 5.334 x 1.93: 1 -4.826,0; 2 4.826,0

### Placement (x,y rotation side)
C1  52.19,34.37 0 top
C2  57.59,83.05 90 top
C3  30.17,2.64 270 top
C4  22.47,86.15 180 top
C5  30.75,86.15 180 top
C6  73,15.47 270 top
C7  27.76,61.95 0 top
C8  18.08,67.89 0 top
C9  48.69,78.49 0 top
C10  17.8,39.42 0 top
C11  85.57,13.05 90 top
C12  62.45,83.4 270 top
C13  50.7,37.74 0 top
C14  83.72,5.48 90 top
C15  75.28,7.82 90 top
C16  18.08,70.66 180 top
C17  40.09,11.67 90 top
C18  58.55,43.23 270 top
C19  42.79,54.61 0 top
C20  53.4,54.61 180 top
C21  79.38,49.73 270 top
C22  25.73,77.27 180 top
C23  79.87,67.53 180 top
C24  71.87,71.08 90 top
C25  70.16,66.31 270 top
C26  70.61,60.87 270 top
C27  70.53,52.95 0 top
C28  75.37,60.06 180 top
C29  82.22,46.58 180 top
C30  76.7,75.96 0 top
C31  41.07,45.16 180 top
C32  3.07,45.36 0 top
CHORD  65.75,44.34 0 top
D1  37.62,92.1 180 top
D2  37.62,97.18 0 top
D3  17.7,33.48 0 top
D4  17.81,31.24 180 top
D5  45.63,32.26 0 top
D6  45.7,34.45 180 top
FHI  16.75,73.46 0 top
FI  10.41,65.87 90 top
FILTER  12.87,91.2 0 top
FILTER_ATT  18.49,50.64 0 top
FLO  6.63,73.54 0 top
FMID  11.69,73.51 0 top
FREQ_COARSE  48.42,91.22 0 top
FREQ_FINE  55,72.2 0 top
IC1  50.35,7.55 0 top
IC2  31.72,73.49 180 bottom
IC3  41.54,73.71 180 top
IC4  6.02,52.74 270 top
IC5  79.99,9.42 180 top
IC6  49.93,45.6 270 top
IC7  86.34,49.86 90 top
IC8  23.98,73.66 90 top
IC9  64.73,55.88 180 top
IC10  75.39,68.7 180 top
IC11  66.6,68.59 180 top
J_CHORD_IN  65.82,22.17 180 top
J_CHORD_INV  65.86,6.15 180 top
J_CV  49.86,22.25 0 top
J_CV_RINGSYNC  89.46,22.21 0 top
J_FILTER  18.64,22.2 0 top
J_FILTER_IN  8.09,6.11 180 top
J_FILTER_TYPE  18.67,6.14 180 top
J_MOD_TYPE  80.04,22.11 0 top
J_OUT  89.43,6.1 180 top
J_PWM  86.32,58.23 90 top
J_RES  7.93,22.16 0 top
J_WAVEFORM  33.69,22.28 90 top
JP3  20.87,62.21 0 bottom
LED_RING  82.22,44.25 0 top
LED_SYNC  89.84,44.25 0 top
NOISE  29.9,44.23 0 top
PGM  76.34,55.42 270 bottom
PULSE  29.85,59.5 0 top
PWM_ATTR  86.29,72.23 0 top
PWM_OFF  83.76,91.22 0 top
R1  25.17,22.9 180 top
R2  23.09,34.7 90 top
R3  38.3,28.94 0 top
R4  26.44,1.83 270 top
R5  40.06,89.05 0 top
R6  73.08,10.7 90 top
R7  11.24,59.71 0 top
R8  89.16,29.53 0 top
R9  25.17,18.41 0 top
R10  84.66,81.63 180 top
R11  24.41,1.78 270 top
R12  91.68,80.92 270 top
R13  93.4,30.63 90 top
R14  93.45,48.8 90 top
R15  81.08,49.66 90 top
R16  26.54,48.55 270 top
R17  26.54,53.69 270 top
R18  26.56,58.68 270 top
R19  26.36,43.54 270 top
R20  16.83,76.66 180 top
R21  76.5,46.71 270 top
R22  92.74,46.26 0 top
R23  83.17,16.48 0 top
R24  83.16,14.78 180 top
R25  11.15,12.27 0 top
R26  91.72,84.77 90 top
R27  78.07,30.23 270 top
R28  44.43,30.22 180 top
R29  75.21,11.7 270 top
R30  87.54,13.02 90 top
R31  76.22,30.2 90 top
R32  13.64,80.92 180 top
R33  23.02,39.32 90 top
R34  29.23,71.54 90 top
R35  25.35,68.06 0 top
R36  26.83,69.6 0 top
R37  9.86,80.92 180 top
R38  83.74,9.19 90 top
R39  66.67,63.45 180 top
R40  66.67,61.01 0 top
R41  75.21,63.96 0 top
R42  93.4,39.98 270 top
R43  68.4,11.63 180 top
R44  63.22,11.63 180 top
R49  53.54,81.13 0 top
R57  61.63,76.87 0 top
R58  76.72,74.02 0 top
R59  76.64,79.61 0 top
R60  76.76,77.88 180 top
R62  54.33,84.79 90 top
R63  61.69,75.04 0 top
R76  56.08,23.53 270 top
R80  79.12,44.14 270 top
R81  86.27,44 270 top
R82  6.21,76.61 0 top
R83  11.54,76.57 0 top
RES  9.06,36.59 0 top
RS  85.98,36.6 90 top
SAW  29.82,54.44 0 top
SV5  26.37,95.79 90 bottom
TRI  29.87,49.34 0 top
TX  37.62,62.03 270 bottom
U2  69.34,56.36 270 top
U3  34.67,5.03 0 bottom
U4  62.41,91.69 90 bottom
VCO_TRIM  69.93,80.65 180 bottom
WF  33.71,36.61 90 top
XWAVES  39.75,86.21 180 top
Y2  48.1,58.56 180 top

### Tracks (layer width: path | path; a pad name or v marks a point on that pad's centre or on a via)
+5V  (via drill 0.33, 0.51)
  Top 0.305: IC6.38 55.78,44.75 57.12,44.75 57.89,43.99 C18.1 v58.55,45.36 | C31.1 42.49,45.16 42.9,45.57 44.1,45.57 IC6.17 45.71,45.6 v45.75,45.57 | v50.62,47.8 50.62,49.83 50.83,50.04 50.83,51.31 IC6.5 | 7.98,57.18 IC4.16 11.17,57.18 v11.2,57.15 | 7.75,49.63 9.03,49.63 IC4.10 | IC2.25 24.1,65.8 26.85,63.04 26.85,62.1 C7.1 26.85,61.8 v26.85,60.81
  Top 0.406: 7.34,49.63 7.34,49.22 v6.93,48.82 | 7.75,49.63 7.34,49.63 | 7.34,49.63 7.34,56.54 7.98,57.18 | IC3.16 45.98,68.77 v45.95,68.73 | C9.1 47.57,78.13 v47.57,76.66 47.45,76.78 IC3.1 | R21.2 76.5,45.03 v76.02,44.55 | IC1.18 54.8,16.01 v55.09,16.31 | v70.13,64.26 70.13,65.51 C25.2 68.95,65.54 IC11.8 | RS.P$2 81.74,31.52 81.1,32.16 73.38,32.16 v72.16,30.94 | C3.1 33.65,3.4 v34.57,2.49
  Top 0.61: D6.C 47.6,35.23 48.39,36.02 53.26,36.02 53.87,35.41 53.87,34.45 C1.+ 55.68,34.37 v55.7,34.39 | C32.1 2.31,43.99 v1.65,43.33
  POWER 0.305: 55.7,42.72 55.91,42.72 v58.55,45.36 | v45.75,45.57 47.17,45.57 48.18,46.58 51.84,46.58 | 53.26,46.58 51.84,46.58 | 51.84,46.58 v50.62,47.8 | v11.2,57.15 11.2,59.59 | FI.P$2 6.62,60.81 10.19,60.81 11.2,59.79 11.2,59.59 | 11.2,59.59 12.01,58.78 15.67,58.78 17.09,60.2 26.44,60.2 v26.85,60.81
  POWER 0.406: v6.93,48.82 6.93,45.16 5.11,43.33 v1.65,43.33 | v45.95,68.73 47.57,68.73 48.18,69.34 48.18,75.84 48.59,76.25 47.98,76.25 v47.57,76.66 | XWAVES.2 37.21,87.22 38.02,88.04 51.84,88.04 53.06,86.82 53.06,74.22 53.37,73.91 | v76.02,44.55 76.02,37.67 78.79,37.67 84.94,31.52 | v55.09,16.31 55.09,18.95 54.18,19.86 | 74.6,57.35 74.6,59.79 v70.13,64.26 | v72.16,30.94 72.16,28.9 69.11,25.86 65.44,25.86 65.25,25.67
  POWER 0.61: RS.P$2 84.94,31.52 86.59,33.17 86.59,49.22 78.46,57.35 74.6,57.35 73.79,56.54 73.79,55.43 PGM.2 | v34.57,2.49 34.57,14.27 | 34.57,14.27 34.57,26.86 | 34.57,26.86 WF.P$2 | 34.57,26.86 47.18,26.86 | 47.18,26.86 54.18,19.86 54.69,19.35 | 47.18,26.86 47.18,27.7 48.79,29.31 54.89,29.31 55.5,29.92 | 55.5,29.92 55.7,30.12 v55.7,34.39 55.7,42.72 53.26,45.16 53.26,46.58 53.26,56.74 59.16,62.64 59.16,66.09 54.08,71.17 54.08,73.2 53.37,73.91 51.03,76.25 48.59,76.25 | J_CHORD_IN.P$2 65.25,25.67 59.75,25.67 55.5,29.92 | v1.65,43.33 1.65,20.78 3.89,18.54 7.81,18.54 J_RES.P$2 11.9,18.66 16.28,14.27 34.57,14.27
  Bottom 0.61: U3.VOUT 34.53,2.53 v34.57,2.49
+12V  (via drill 0.33, 0.51)
  Top 0.406: 21.16,71.53 IC8.8 | 77.24,66.04 IC10.8 | IC7.8 84.76,46.93 v84.76,46.79 84.56,46.58 C29.1 | v82.12,4.72 82.2,4.72 82.2,6.52 IC5.8 82.47,6.25 C14.2 | IC1.1 39.68,2.52 v39.65,2.49 | U2.3 68.4,59.69 68.91,60.2 68.91,61.21 69.32,61.62 | 69.32,61.62 70.6,61.62 C26.1 72.19,61.63 C28.+ | C28.+ 73.77,60.18 75.21,61.62 77.44,61.62 78.66,62.84 78.66,64.73 IC10.8 | IC10.8 77.68,66.1 C23.2 | R37.2 9.09,79.37 v9.37,79.1 | v19.33,76.45 19.33,72.59 20.35,71.58 21.2,71.58 IC8.8 | C16.1 20.29,70.66 | 20.29,70.66 IC8.8 | 20.29,70.66 20.29,70.71 20.95,71.37 v21.77,70.56 | R26.2 91.72,86.97 91.26,87.43 59.97,87.43 v59.77,87.63 | R63.2 62.45,74.06 v62.2,73.81 | 69.32,61.62 69.11,61.62 v68.71,62.03 | R62.2 54.33,87.07 v54.69,87.43 | C28.+ 73.77,59.2 74.6,58.37 77.44,58.37 78.26,57.56 v78.26,56.13
  Top 0.61: v37.41,89.66 37.41,89.7 D1.C | C2.+ 57.59,84.73 56.72,85.6 | 56.72,85.6 54.37,85.6 R62.2 | 56.72,85.6 57.73,85.6 v59.77,87.63
  Top 0.813: D1.C 39.82,92.47 42.29,94.94 v55.91,94.94
  POWER 0.406: 73.58,46.79 78.26,46.79 | 78.26,46.79 v84.76,46.79 | 79.68,2.29 v82.12,4.72 | v9.37,79.1 12.62,79.1 | v21.77,70.56 21.56,70.56 20.14,69.14 15.47,69.14 14.45,68.12 14.45,65.28 15.06,64.67 15.27,64.67 15.47,64.46 22.38,64.46 23.39,63.45 23.39,62.23 JP3.1 | v62.2,73.81 62.2,68.33 60.38,66.5 | v54.69,87.43 55.7,87.43 55.91,87.63 | v78.26,56.13 78.26,46.79
  POWER 0.61: v19.33,76.45 18.31,77.47 14.25,77.47 12.62,79.1 12.62,81.53 13.84,82.75 16.48,82.75 17.91,84.18 17.91,86.82 18.52,87.43 35.18,87.43 v37.41,89.66
  POWER 0.813: v55.91,94.94 55.91,87.63 55.91,71.17 60.38,66.7 60.38,66.5 60.38,51.05 65.86,45.57 65.86,43.33 73.58,35.61 | v39.65,2.49 39.65,1.47 40.46,0.66 62.2,0.66 64.44,2.9 73.18,2.9 73.58,2.49 | 79.68,2.29 73.79,2.29 73.58,2.49 | 73.58,35.61 73.58,46.79 | 73.58,35.61 73.58,2.49
  Bottom 0.61: v59.77,87.63 59.77,89.05 U4.VIN
  Bottom 0.813: U3.VIN 39.61,2.53 v39.65,2.49
-12V  (via drill 0.33, 0.51)
  Top 0.406: C17.1 40.58,10.91 41.27,10.21 42.9,10.21 43.31,10.62 43.31,12.52 IC1.27 43.37,14.07 43.57,14.27 v44.32,14.27 | v71.35,9.4 72.16,8.58 C15.2 76.43,8.58 78.05,10.21 78.05,11.98 IC5.4 78.07,12.04 v76.83,12.04 | IC7.4 88.94,53 v89.03,53.09 | IC10.4 72.51,70.32 C24.1 71.87,69.23 v71.96,69.14 | C12.- 63.23,85 v64.24,86 | C22.1 26.49,75.79 26.64,75.64 25.22,75.64 v24.61,75.03 | v5.71,80.31 v5.71,94.13
  Top 0.61: IC8.4 26.58,76.27 C22.1
  Top 0.813: D2.A 43.1,97.18 v43.92,97.99
  POWER 0.406: v71.35,9.4 71.35,13.26 70.74,14.27 v44.32,14.27 | v76.83,12.04 77.85,11.02 94.31,11.02 95.33,12.04 | v89.03,53.09 94.92,53.09 95.33,52.68 | 94.72,69.14 95.33,69.75 | 63.83,97.99 64.24,97.59 v64.24,86 63.83,85.6 63.83,75.23 64.44,74.62 71.55,74.62 71.96,74.22 v71.96,69.14 | v24.61,75.03 14.86,75.03 11.81,78.08 7.95,78.08 v5.71,80.31 | v5.71,94.13 5.71,97.18 7.75,99.21 42.7,99.21 v43.92,97.99
  POWER 0.813: v43.92,97.99 63.83,97.99 92.48,97.99 95.33,95.15 95.33,69.75 95.33,52.68 95.33,12.04 95.33,10.21
A
  Top 0.203: IC6.36 56.85,43.2 57.53,42.52 57.53,40.28 56.72,39.47 56.72,37.85 60.58,33.98 60.58,15.9 60.17,15.49 60.17,9.6 59.36,8.79 56.51,8.79 55.91,9.4 55.91,11.61 IC1.17
A_IN  (via drill 0.33)
  Top 0.203: C10.+ 19.4,40.42 18.72,41.1 14.45,41.1 v13.84,41.71 | v19.33,59.18 24,59.18 25.63,60.81 25.63,62.43 22.17,65.89 IC2.26
  Bottom 0.203: v13.84,41.71 13.84,44.96 17.09,48.21 17.09,53.7 19.33,55.93 v19.33,59.18
ADC_MISO  (via drill 0.33)
  Top 0.203: IC6.2 53.13,52.35 53.47,52.68 56.11,52.68 v57.33,51.46 | v64.44,51.36 64.44,52.92 IC9.6
  Bottom 0.203: v57.33,51.46 v64.44,51.36 64.54,51.26 69.93,51.26 72.82,54.15 75.31,54.15 76.34,55.23 PGM.1
ADC_SCK  (via drill 0.33)
  Top 0.203: IC6.3 52.33,52.36 53.06,53.09 56.72,53.09 v57.33,52.48 | IC9.7 65.05,52.94 v65.05,52.07 65.51,51.61 75.72,51.61 75.77,51.66 75.82,51.66 76.34,52.18 PGM.3
  Bottom 0.203: v57.33,52.48 64.64,52.48 v65.05,52.07
ADC_SS  (via drill 0.33)
  Top 0.203: IC6.19 47.03,44 v48.39,45.36 | v50.01,53.7 v57.33,53.7 | v66.47,58.78 65.74,58.78 IC9.1
  Bottom 0.203: v48.39,45.36 48.39,52.07 v50.01,53.7 | v57.33,53.7 61.19,53.7 61.8,54.3 61.8,58.37 62.2,58.78 v66.47,58.78
AREF  (via drill 0.33)
  Top 0.203: U2.4 68.71,55.04 68.71,53.49 69.25,52.95 C27.1 | IC6.29 50.73,38.95 51.23,38.46 51.23,37.96 C13.2
  Top 0.305: IC6.27 49.13,41.44 49.2,41.5 50.22,41.5 | 50.22,41.5 50.83,41.5 | 50.83,41.5 50.83,39.9 IC6.29 50.73,41.41 50.83,41.5 | IC9.8 68.17,52.95 68.71,53.49 68.71,55.12 67.69,55.12 67.28,55.52 v67.28,58.98 | v49.61,49.22 49.61,42.11 50.22,41.5
  Bottom 0.305: v67.28,58.98 67.28,60.2 66.47,61.01 57.53,61.01 56.51,59.99 56.51,55.32 55.5,54.3 55.5,51.46 53.26,49.22 v49.61,49.22
B
  Top 0.203: IC1.16 57.23,9.9 57.94,9.19 59.16,9.19 59.77,9.8 59.77,15.7 60.17,16.1 60.17,33.78 56.31,37.64 56.31,39.67 57.12,40.49 57.12,42.32 56.92,42.52 55.85,42.52 IC6.35
C
  Top 0.203: 56.41,41.6 IC6.34 55.91,41.43 55.91,37.44 59.77,33.58 59.77,16.71 58.61,15.55 IC1.15
CS/RW  (via drill 0.33)
  Top 0.203: IC2.7 IC2.8 | IC6.44 55.96,49.83 58.34,49.83 59.56,51.05 59.56,60.4 57.94,62.03 43.31,62.03 v41.27,64.06
  Bottom 0.203: v41.27,64.06 36.19,64.06 35.59,64.67 35.59,79.78 IC2.8
D  (via drill 0.33)
  Top 0.203: IC1.14 58.61,4.56 v57.33,6.04 | IC6.33 53.87,39.74 53.87,38.86 59.36,33.38 59.36,17.12 v57.33,15.09
  Bottom 0.203: v57.33,6.04 v57.33,15.09
D0
  Top 0.203: IC3.3 43.44,75.3 44.12,74.62 47.17,74.62 47.98,73.81 47.98,70.36 49.61,68.73 49.61,65.98 IC2.15 49.5,64.17 50.01,63.65 58.75,63.65 61.19,61.21 61.19,50.24 57.33,46.38 55.76,46.38 IC6.40
D1
  Top 0.203: IC3.4 42.17,75.35 43.31,74.22 46.76,74.22 47.37,73.61 47.37,66.29 IC2.16 46.96,63.86 47.57,63.25 58.55,63.25 60.78,61.01 60.78,50.44 57.53,47.19 55.74,47.19 IC6.41
D2
  Top 0.203: IC3.6 39.63,75.46 41.27,73.81 46.15,73.81 46.76,73.2 46.76,68.22 IC2.17 44.42,63.97 45.54,62.84 58.34,62.84 60.38,60.81 60.38,50.65 57.73,48.01 IC6.42
D3
  Top 0.203: IC3.11 39.63,68.12 IC2.18 41.9,65.87 45.34,62.43 58.14,62.43 59.97,60.6 59.97,50.85 57.94,48.82 55.75,48.82 IC6.43
D4  (via drill 0.33)
  Top 0.203: 39.45,65.76 IC2.19 39.24,65.78 39.24,52.48 40.32,51.4 IC6.11 | v42.09,68.73 42.09,70.55 IC3.13
  Bottom 0.203: IC2.19 39.34,65.98 v42.09,68.73
D5  (via drill 0.33)
  Top 0.203: 36.6,65.68 IC2.20 35.99,65.07 35.99,52.88 39.27,49.6 IC6.12 | v43.51,68.73 43.51,70.57 IC3.14
  Bottom 0.203: IC2.20 36.8,66.69 39.45,69.34 42.9,69.34 v43.51,68.73
D6
  Top 0.203: IC2.21 34.16,65.78 34.16,64.87 35.59,63.45 35.59,52.68 39.46,48.8 IC6.13
D7
  Top 0.203: IC2.22 32.55,65.87 32.55,64.86 32.94,64.46 33.96,64.46 35.18,63.25 35.18,52.48 39.65,48.01 IC6.14
GND  (via drill 0.33)
  Top 0.203: 73.58,66.19 IC10.5 | IC11.5 64.69,65.94
  Top 0.305: 70.6,67.51 C25.1 | 74.8,69.3 74.76,69.34
  Top 0.406: 70.13,68.53 70.13,67.1 C25.1 | 73.58,66.19 73.58,68.17 74.76,69.34 IC10.3 | C24.2 70.6,71.84 70.13,71.37 70.13,68.53 | v64.24,63.65 64.24,65.54 IC11.5 64.69,67.77 64.9,67.77 v65.46,68.33 | IC11.3 IC11.4 63.65,71.19 v60.99,68.53 | IC1.12 56.07,5.29 v56.11,5.33 | v70.94,68.53 70.13,68.53 | IC10.5 72.57,66.1 v72.36,65.89
  Bottom 0.406: v64.24,63.65 v61.8,63.65
  other vias: 4.09,96.16 4.09,92.91 4.09,89.66 4.09,86.41 4.09,83.16 65.25,84.79 60.99,96.37 90.25,95.35 93.5,92.91 93.5,89.66 93.5,76.66 93.5,73.41 93.5,66.9 78.87,58.78 77.24,84.79 80.49,81.53 80.49,78.28 61.8,65.28 72.36,4.11 72.36,32.77 67.49,32.77 64.24,32.77 34.98,29.51 29.9,29.51 25.22,29.51 25.22,36.02 12.22,44.15 8.97,44.15 25.22,32.77 59.36,39.27 57.73,57.15 57.73,58.78 46.66,48.31 42.6,52.37 2.46,14.88 2.46,10.01 2.46,6.76 2.46,3.51 42.29,39.27 46.66,46.38 44.42,52.37 12.22,53.7 14.86,53.7 14.86,56.54 23.6,56.54 62.2,59.79 59.36,69.75 77.24,88.24 62.2,53.29 71.55,54.71 71.15,58.78 83.95,95.35 77.24,95.55 79.68,54.1 57.12,17.73 62.61,17.93 46.15,17.53 57.53,32.77 49.4,30.73 52.65,30.73 33.55,78.89 33.55,77.06 33.55,75.23 26.85,12.04 26.85,15.7
  pour Bottom: -1.04,101.4 98.93,101.38 98.52,-1.29 -1.04,-1.47
  pour Top: -1.04,101.4 98.67,101.17 98.67,-1.09 -1.04,-1.47
  pour Route2: -0.99,100.63 98.58,100.63 98.58,-1.17 -1.19,-1.17 -1.19,100.63
I5  (via drill 0.33)
  Top 0.203: IC7.7 81.4,49.22 R15.1 | IC1.23 48.45,14.13 48.59,14.27 52.45,14.27 v53.67,15.49 | v75.62,32.97 75.62,42.93 80.9,48.21 80.9,48.72 R15.1 | C21.2 81,48.97 R15.1
  Bottom 0.203: v53.67,15.49 53.67,16.51 58.55,21.39 58.55,29.92 62.61,33.98 74.6,33.98 v75.62,32.97
I6  (via drill 0.33)
  Top 0.203: RES.2 9.91,29.59 13.03,26.47 13.03,15.7 v12.22,14.88 | v47.17,9.6 47.17,12.57 IC1.24
  Bottom 0.203: v12.22,14.88 12.22,13.87 14.86,11.23 23.6,11.23 26.44,8.38 28.07,8.38 28.68,8.38 45.95,8.38 v47.17,9.6
I7  (via drill 0.33)
  Top 0.203: 20.17,73.02 IC8.7 22.56,73.02 22.99,72.59 22.99,69.66 R35.1 23.66,68.06 22.78,68.94 v21.67,68.94 | IC1.25 45.91,7.93 45.64,7.67 v45.14,7.67 | v2.06,59.28 2.06,68.33 2.67,68.94 v11.61,68.94
  Bottom 0.203: v11.61,68.94 v21.67,68.94 | v2.06,59.28 1.96,59.38 1.45,59.38 0.43,58.37 0.43,21.59 2.06,19.96 9.78,19.96 11.4,18.34 11.4,14.07 14.66,10.82 23.39,10.82 26.24,7.98 44.83,7.98 v45.14,7.67
I8  (via drill 0.33)
  Top 0.203: FI.P$4 13.14,59.71 R7.2 12.01,59.7 12.01,58.98 11.81,58.78 6.32,58.78 5.92,58.37 v2.26,58.37 | IC1.26 44.64,9.69 v44.73,9.6
  Bottom 0.203: v44.73,9.6 44.73,9.4 44.12,8.79 26.85,8.79 24.21,11.43 24.21,12.85 23.19,13.87 12.83,13.87 12.83,18.34 10.79,20.37 2.26,20.37 0.84,21.79 0.84,56.95 v2.26,58.37
I9  (via drill 0.33)
  Top 0.203: IC1.11 54.8,5.43 v54.48,5.74 | v45.95,6.15 42.7,6.15 42.09,6.76 39.24,6.76 38.43,7.57 38.43,16.51 42.29,20.37 42.29,26.87 40.67,28.5 v40.67,40.69 | v45.75,78.49 45.75,81.74 43.31,84.18 42.29,84.18 41.88,84.58 41.88,86.21 | 41.88,86.21 41.88,86.46 41.81,86.54 R5.1 | 41.68,86.41 41.88,86.21 | v40.67,52.07 39.85,52.88 39.85,61.21 v41.07,62.43
  Top 0.254: XWAVES.1 41.48,86.21 41.81,86.54
  Bottom 0.203: v45.95,6.15 46.56,5.54 54.28,5.54 v54.48,5.74 | v40.67,40.69 v40.67,52.07 | v41.07,62.43 42.49,62.43 43.1,63.04 43.1,66.9 43.71,67.51 44.12,67.51 44.32,67.72 44.32,77.06 v45.75,78.49
I10
  Top 0.203: RS.P$4 89.93,31.38 R8.2 89.84,29.44 89.84,28.9 89.43,28.5 88.01,28.5 85.17,25.65 72.36,25.65 70.33,23.62 70.33,16.51 67.69,13.87 62.81,13.87 61.39,12.45 61.39,8.99 59.16,6.76 54.28,6.76 53.53,6 IC1.10
I11
  Top 0.203: IC1.9 52.25,1.07 51.64,0.46 28.47,0.46 28.07,0.86 28.07,2.29 27.86,2.49 26.54,2.49 R4.1
I12
  Top 0.203: CHORD.2 65.75,38.77 65.05,39.47 61.59,39.47 58.75,36.63 58.75,36.42 60.99,34.19 60.99,15.49 60.58,15.09 60.58,9.4 58.95,7.77 52.45,7.77 51.03,6.35 51.03,2.57 IC1.8
I13
  Top 0.203: R9.2 25.93,5.94 28.47,3.4 28.47,1.07 28.68,0.86 49.61,0.86 49.81,1.07 49.81,2.43 IC1.7
I14  (via drill 0.33)
  Top 0.203: WF.P$4 37.52,28.96 R3.1 39,27.48 41.07,27.48 41.88,26.67 41.88,20.57 38.02,16.71 38.02,7.37 39.04,6.35 41.88,6.35 43.31,4.93 v46.15,4.93 | IC1.6 48.45,4.67 v48.18,4.93
  Bottom 0.203: v48.18,4.93 v46.15,4.93
I15  (via drill 0.33)
  Top 0.203: IC1.5 47.18,6.15 47.27,6.25 v49.61,6.25 | R31.2 76.19,30.94 75.21,30.94 75.01,30.73 75.01,26.47 74.6,26.06 72.16,26.06 69.93,23.82 69.93,16.71 67.49,14.27 62.61,14.27 60.99,12.65 60.99,9.19 58.95,7.16 53.26,7.16 52.35,6.25 v51.84,6.25
  Bottom 0.203: v49.61,6.25 v51.84,6.25
I16  (via drill 0.33)
  Top 0.203: R44.2 62.46,10.46 v62.41,10.41 | v45.14,4.32 45.54,4.32 45.95,3.91 45.95,2.57 IC1.4
  Bottom 0.203: v62.41,10.41 62.41,5.94 60.78,4.32 v45.14,4.32
LED_A
  Top 0.203: R16.2 25.64,47.79 25.22,48.21 25.22,56.95 24.82,57.35 13.03,57.35 11.61,55.93 9.12,55.93 IC4.15
LED_B
  Top 0.203: IC4.1 5.34,57.18 6.53,58.37 25.43,58.37 25.73,58.67 27.76,58.67 27.86,58.57 27.86,56.54 28.27,56.13 29.29,56.13 29.9,55.52 29.9,53.29 29.29,52.68 26.78,52.68 R17.2
LED_C
  Top 0.203: R18.2 6.69,57.92 4.7,55.93 2.46,55.93 2.26,56.13 2.73,56.13 IC4.2
LED_CLOCK  (via drill 0.33)
  Top 0.203: IC4.11 10.61,50.83 11.4,50.04 11.4,47.8 13.03,46.18 v23.8,46.18 | v53.06,37.44 53.06,39.73 IC6.32
  Bottom 0.203: v23.8,46.18 24.21,46.18 27.86,42.52 27.86,39.67 30.91,36.63 52.25,36.63 v53.06,37.44
LED_D
  Top 0.203: IC4.3 4.56,54.64 5.92,53.29 5.92,46.18 6.32,45.77 22.78,45.77 25.78,42.78 R19.2
LED_DATA_IN  (via drill 0.33)
  Top 0.203: IC4.14 22.65,54.64 v23.8,53.29 | v47.57,53.29 47.57,51.44 IC6.9
  Bottom 0.203: v23.8,53.29 v47.57,53.29
LED_E
  Top 0.203: IC4.4 2.83,53.49 1.85,53.49 1.45,53.9 1.45,73.61 2.67,74.83 15.67,74.83 16.08,75.23 R20.2
LED_ENABLE  (via drill 0.33)
  Top 0.203: IC6.21 42.51,42.4 v42.49,42.42 | IC4.12 9.13,52.07 10.79,52.07 11.81,51.05 11.81,48.01 13.23,46.58 22.78,46.58 22.99,46.79 v25.22,46.79
  Bottom 0.203: v42.49,42.42 41.99,42.42 41.68,42.11 41.68,37.85 41.07,37.24 31.11,37.24 28.47,39.88 28.47,42.72 25.22,45.97 v25.22,46.79
LED_F
  Top 0.203: R83.2 12.3,75.73 11.81,75.23 2.46,75.23 1.04,73.81 1.04,52.48 1.45,52.07 2.92,52.07 IC4.5
LED_G
  Top 0.203: R82.2 6.97,77.64 6.32,78.28 2.67,78.28 0.63,76.25 0.63,52.27 2.06,50.85 2.93,50.85 IC4.6
LED_H  (via drill 0.33)
  Top 0.203: R80.2 79.12,39.72 v78.87,39.47 | v25.43,41.3 25.43,42.52 22.99,44.96 22.58,45.36 6.12,45.36 5.51,45.97 5.51,48.82 4.77,49.56 IC4.7
  Bottom 0.203: v78.87,39.47 78.87,39.06 78.46,38.66 73.58,38.66 70.33,35.41 57.12,35.41 56.51,36.02 30.71,36.02 v25.43,41.3
LED_I  (via drill 0.33)
  Top 0.203: R81.2 86.27,39.96 v84.56,38.25 | v39.65,35.31 39.65,41.91 41.07,43.33 44.01,43.33 IC6.20
  Bottom 0.203: v84.56,38.25 73.79,38.25 70.54,35 56.92,35 56.31,35.61 40.06,35.61 v39.65,35.31
LED_I/MOSI  (via drill 0.33)
  Top 0.203: v63.83,50.44 63.83,52.88 IC9.5 | IC6.1 56.37,51.4 v57.33,50.44
  Bottom 0.203: v57.33,50.44 v63.83,50.44 71.35,50.44 73.78,52.88 PGM.4
M0  (via drill 0.33)
  Top 0.203: R28.1 45.14,30.28 45.14,31.34 44.21,32.26 D5.C 43.73,34.38 D6.A 43.8,39.35 v48.39,43.94 | v52.25,43.94 55.67,43.94 IC6.37
  Bottom 0.203: v48.39,43.94 v52.25,43.94
N$1
  Top 0.406: 35.3,97.06 D2.C
  Top 0.813: SV5.1 SV5.2 35.42,97.06 D2.C
N$2  (via drill 0.51)
  POWER 0.813: v57.94,96.37 40.46,96.37 32.74,88.65 4.7,88.65 1.45,85.39 1.45,66.29 4.09,63.65 16.89,63.65 JP3.3
  Bottom 0.813: U4.VOUT 59.3,95.01 v57.94,96.37
N$3
  Top 0.406: SV5.9 21.29,93.39
  Top 0.813: SV5.10 SV5.9 | 21.29,93.39 21.5,93.39 22.78,92.1 D1.A
N$4
  Top 0.203: R39.1 71.75,63.45 72.97,62.23 75.62,62.23 76.02,62.64 76.02,63.91 R41.2 75.97,66.04 IC10.7
N$5  (via drill 0.33)
  Top 0.203: IC10.6 74.76,64.27 R41.1 74.35,63.86 v72.97,63.86 | R13.2 93.4,36.73 92.28,37.85 92.28,42.11 94.51,44.35 94.51,52.07 92.48,54.1 92.48,55.52 94.51,57.56 94.51,61.21 v93.7,62.03 | v88.01,62.03 v80.09,62.03
  Bottom 0.203: v93.7,62.03 v88.01,62.03 | v80.09,62.03 74.8,62.03 v72.97,63.86
N$6
  Top 0.203: IC2.1 16.48,82.7 C4.2
N$7
  Top 0.203: J_CV_RINGSYNC.P$1 92.62,27.21 93.5,28.09 93.5,29.77 R13.1 94.26,29.87 94.92,30.53 94.92,38.86 94.51,39.27 93.45,39.27 R42.2
N$8
  Top 0.203: IC2.2 19.02,82.64 20.75,84.38 23.03,84.38 C4.1
N$9
  Top 0.203: IC11.6 65.96,64.06 | 65.96,64.06 65.96,63.5 R39.2 | R40.1 65.91,64.01 65.96,64.06
N$10
  Top 0.203: IC2.3 21.56,81.32 24.61,84.38 26.23,84.38 C5.2
N$11
  Top 0.203: IC2.4 24.19,81.11 27.46,84.38 31.31,84.38 C5.1
N$12
  Top 0.203: IC3.2 44.71,78.3 44.12,78.89 42.29,78.89 40.67,80.52 40.67,81.94 40.26,82.35 37.21,82.35 36.8,81.94 IC2.9
N$13
  Top 0.203: IC3.5 40.9,79.55 IC2.10
N$14
  Top 0.203: IC2.11 41.88,81.95 41.07,82.75 36.4,82.75 35.59,81.94 35.59,79.7 36.6,78.69 37.82,78.69 38.43,78.08 38.43,76.85 IC3.7
N$15  (via drill 0.33)
  Top 0.203: IC2.12 44.53,81.22 44.02,81.22 41.88,83.36 31.32,83.36 30.51,82.55 v30.51,75.64 | IC3.10 38.36,72.46 38.02,72.8 v30.91,72.8
  Bottom 0.203: v30.91,72.8 30.91,75.23 v30.51,75.64
N$16  (via drill 0.33)
  Top 0.203: IC3.12 40.9,72.15 v40.87,72.19
  Bottom 0.203: v40.87,72.19 40.87,75.03 IC2.13
N$17
  Top 0.203: IC3.15 44.73,70.65 44.73,72.19 43.51,73.41 30.1,73.41 29.08,74.42 29.08,78.89 26.86,81.11 IC2.5
N$18
  Top 0.203: FHI.A 15.53,73.46 17.5,75.44 17.5,76.57 R20.1
N$19
  Top 0.203: IC5.1 82.3,12.02 83.95,13.66 83.95,14.75 R24.1 86.64,14.78 R30.2
N$20
  Top 0.203: J_CHORD_IN.P$1 69.17,17.17 69.52,17.53 69.52,36.08 CHORD.3
  Bottom 0.203: 68.3,37.3 CHORD.3
N$21
  Top 0.203: IC3.9 37.09,69.22 35.99,68.12 31.72,68.12 30.3,66.7 30.3,64.67 31.32,63.65 33.55,63.65 34.37,62.84 34.37,52.07 40.03,46.4 IC6.16
N$22
  Top 0.203: 75.16,12.42 R29.1 75.21,12.85 76.23,13.87 | 76.23,13.87 79.27,13.87 79.48,13.66 79.48,12.13 IC5.3 | C6.- 73.03,17.07 76.23,13.87
N$23
  Top 0.203: IC5.2 80.63,13.02 R24.2 82.39,16.4 R23.1
N$24  (via drill 0.33)
  Top 0.203: IC6.15 39.84,47.2 34.77,52.27 34.77,63.04 33.76,64.06 31.52,64.06 v31.52,64.46
  Bottom 0.203: IC2.6 29.08,81.02 29.08,72.59 30.51,71.17 30.51,65.07 31.11,64.46 v31.52,64.46
N$25  (via drill 0.33)
  Top 0.203: v8.56,76.45 10.66,76.45 R83.1
  Bottom 0.203: FMID.A 10.42,74.6 v8.56,76.45
N$26  (via drill 0.33)
  Top 0.203: v3.28,76.45 5.29,76.45 R82.1
  Bottom 0.203: FLO.A 5.36,74.37 v3.28,76.45
N$27
  Top 0.203: R28.2 43.71,30.18 43.71,16.1 42.09,14.48 42.09,12.59 IC1.28
N$28
  Top 0.203: J_WAVEFORM.P$1 28.49,23.4 27.05,24.84 25.02,24.84 24.21,24.03 24.21,23.1 R1.2 R9.1
N$29
  Top 0.406: R80.1 80.29,44.9 LED_RING.A
N$30
  Top 0.203: R25.2 12.45,12.27 13.44,13.26 13.44,28.77 D4.A D3.C | D3.C 15.91,34.83 16.69,35.61 23.55,35.61 R2.2 | D3.C 15.91,39.12 C10.-
N$31
  Top 0.203: R81.1 88.06,44.76 LED_SYNC.A
N$32
  Top 0.203: J_CV.P$1 53.12,27.25 R76.1
N$33
  Top 0.203: R4.2 24.46,1.07 R11.2 24.28,1.14 J_FILTER_TYPE.P$1
N$34
  Bottom 0.203: J_RES.P$1 9.13,27.16 RES.3
N$35
  Top 0.203: PWM_OFF.2 83.76,81.76 R10.2
N$36
  Top 0.203: IC7.2 90.65,49.22 90.99,49.56 R14.2 93.59,49.43 93.59,51.98 91.26,54.3 91.26,65.28 | 91.26,65.28 91.26,65.89 86.79,70.36 86.79,73 92.48,78.69 92.48,82.35 92.07,82.75 87.2,82.75 86.07,81.63 R10.1 | PWM_ATTR.3 91.21,65.23 91.26,65.28
N$37
  Top 0.203: TRI.A 26.57,49.34 R16.1
N$38
  Top 0.203: SAW.A R17.1
N$39
  Top 0.203: PULSE.A 26.62,59.5 R18.1
N$40
  Top 0.203: NOISE.A 26.43,44.23 R19.1
N$41  (via drill 0.33)
  Top 0.203: v84.15,67.51 84.56,67.51 85.78,68.73 85.78,73.2 90.45,77.88 90.45,80.46 R12.1
  Bottom 0.203: J_PWM.P$1 81.32,64.45 80.49,65.28 80.49,67.11 80.9,67.51 v84.15,67.51
N$42
  Top 0.203: R30.1 86.88,12.36 86.59,12.65 86.59,13.46 86.18,13.87 85.62,13.87 C11.2 85.57,13.66 81.71,9.8 78.87,9.8 78.05,8.99 78.05,6.85 IC5.5
N$43
  Top 0.203: PWM_ATTR.2 86.29,73.1 91.67,78.49 91.67,80.15 R12.2
N$44
  Top 0.203: IC7.1 93.36,47.95 | 93.36,47.95 R14.1 | 93.36,47.95 93.36,46.4 R22.2
N$45  (via drill 0.33)
  Top 0.203: R22.1 87.93,46.26 87.2,46.99 87.2,50.04 86.79,50.44 83.78,50.44 IC7.6 | IC7.6 81.15,50.49 R15.2 79.5,50.42 C21.1 | IC7.6 85.01,50.49 85.78,51.26 v85.78,53.9
  Bottom 0.203: PWM_ATTR.1 83.79,55.89 v85.78,53.9
N$46
  Top 0.203: PWM_OFF.3 91.51,84.22 R26.1
N$47
  Top 0.203: J_MOD_TYPE.P$1 77,27.11 76.23,27.89 R31.1 78.03,29.44 R27.2
N$48
  Top 0.203: R32.2 12.87,81.23 12.87,81.78 13.13,82.04 14.96,82.04 16.89,83.97 16.89,85.19 15.87,86.21 13.64,86.21 12.83,85.39 12.83,84.25 FILTER.2
N$49  (via drill 0.33)
  Top 0.203: R32.1 14.4,79.76 v15.67,78.49 | v27.46,78.49 28.47,77.47 28.47,73.61 27.86,73 | 27.86,73 26.6,73 IC8.2 | 27.86,73 28.53,73 R34.2 30.51,71.02 30.51,69.34 27.86,66.7 27.86,64.87 29.49,63.25 33.35,63.25 33.96,62.64 33.96,51.87 35.18,50.65 35.18,42.52 32.94,40.28 24.82,40.28 21.56,43.54 21.09,43.54 FILTER_ATT.3
  Bottom 0.203: v27.46,78.49 v15.67,78.49
N$50
  Top 0.203: J_FILTER.P$1 23.11,27.2 24.21,28.3 24.21,37.37 R33.1
N$51
  Top 0.203: R34.1 27.55,70.78 IC8.1 26.58,71.64 27.59,70.63 R36.2
N$52  (via drill 0.33)
  Top 0.203: IC8.6 23.52,74.29 23.8,74.02 23.8,71.37 | 23.8,71.37 24.61,70.56 25.63,70.56 26.03,70.15 26.03,68.92 | 26.03,68.92 R36.1 | 26.03,68.92 26.03,68.04 R35.2 | v23.8,70.15 23.8,71.37
  Bottom 0.203: FILTER_ATT.1 15.99,46.29 17.7,48.01 17.7,53.49 22.17,57.96 22.17,63.86 22.78,64.46 25.22,64.46 25.43,64.67 25.43,68.53 v23.8,70.15
N$53
  Top 0.406: FILTER.3 15.37,83.67 14.25,82.55 11.2,82.55 10.79,82.14 10.79,81.41 R37.1
N$54  (via drill 0.33)
  Top 0.203: v85.17,8.38 83.79,8.38 R38.1
  Bottom 0.203: J_OUT.P$1 86.56,1.1 86.18,1.47 86.18,7.37 v85.17,8.38
N$55
  Top 0.203: FILTER_ATT.2 18.49,43.36 20.75,41.1 22.78,41.1 22.99,40.89 22.99,40.11 R33.2
N$56
  cutout Bottom: 62.81,73.41 79.68,73.41 79.68,62.64 62.61,62.64 62.61,72.59
N$57
  cutout Top: 62.61,73.41 79.88,73.41 79.88,62.64 62.61,62.64
N$58
  cutout Top: 65.05,83.16 79.68,83.16 79.68,73.41 64.85,73.41 64.85,83.16
N$59
  cutout Bottom: 64.85,83.16 79.68,83.16 79.68,73.41 64.85,73.41
N$60
  Top 0.406: R43.2 67.64,11.58 67.08,11.02 64.59,11.02 64.41,11.2 | 64.41,11.2 R44.1 | 64.41,11.2 62.2,8.99 62.2,2.29 63.55,0.94 65.66,0.94 J_CHORD_INV.P$1
N$79
  Top 0.203: FREQ_COARSE.2 48.42,84.14 49.61,82.96 51.64,82.96 52.45,82.14 52.45,81.21 R49.1
N$80  (via drill 0.33)
  Top 0.203: R49.2 54.3,80.09 56.31,78.08 62,78.08 62.41,77.67 62.41,76.89 R57.2 62.4,76.86 v65.86,76.86 | 76.03,73.95 R58.1 74.8,74.02 v71.96,76.86 | IC10.2 76.03,69.33 76.43,68.94 81.91,68.94 82.32,68.53 82.32,66.9 v81.71,66.29 | 55.91,22.6 R76.2 56.24,22.61 v57.53,22.61
  Top 0.305: IC10.2 76.03,73.95 | C30.1 75.94,74.04 R58.1
  Bottom 0.203: v71.96,76.86 v65.86,76.86 | v57.53,22.61 58.14,23.22 58.14,30.12 62.41,34.39 70.74,34.39 71.35,35 84.96,35 86.18,36.22 86.18,38.05 84.96,39.27 84.96,44.96 82.93,46.99 82.93,63.65 81.51,65.07 81.51,66.09 v81.71,66.29
N$82
  Top 0.203: FREQ_FINE.2 55,75.75 56.31,77.06 60.67,77.06 R57.1
N$83
  Top 0.203: 77.3,73.83 R58.2 77.53,74.06
  Top 0.305: IC10.1 77.3,73.83 | 77.3,75.59 C30.2 | 77.53,74.06 77.53,75.89 C30.2 | C30.2 77.46,77.81 R60.1
N$84
  Top 0.203: 75.78,79.1 R59.1 75.82,79.26
  Top 0.305: IC11.2 67.28,71.25 67.28,76.25 68.71,77.67 68.71,80.11 69.32,80.72 75.41,80.72 75.82,80.31 75.82,79.26 | R60.2 76,79.08 R59.1
N$85
  Top 0.305: VCO_TRIM.E 67.39,81.23 68.1,81.94 69.91,81.94 VCO_TRIM.S 75.63,81.92 77.44,80.11 77.44,79.24 R59.2
N$87
  Top 0.203: FREQ_COARSE.3 54.44,84.22 R62.1
N$88
  Top 0.203: FREQ_FINE.3 57.5,66.12 56.31,67.31 56.31,74.62 56.72,75.03 60.91,75.03 R63.1
OUT  (via drill 0.33)
  Top 0.203: v12.62,64.87 4.09,64.87 3.07,63.86 3.07,59.38 v3.28,59.18 | v14.66,28.5 14.66,27.28 13.84,26.47 13.84,3.5 14.45,2.9 22.38,2.9 v24.21,4.72 | 72.57,13.44 C6.+ 72.91,13.78 72.91,11.43 | v70.54,11.43 72.91,11.43 | 72.91,11.43 R6.2
  Bottom 0.203: IC2.27 19.02,66.61 18.31,67.31 15.06,67.31 v12.62,64.87 | v3.28,59.18 3.28,55.12 7.95,50.44 7.95,35.2 v14.66,28.5 | v24.21,4.72 26.85,7.37 40.87,7.37 45.34,2.9 65.46,2.9 66.07,3.5 66.07,7.16 70.33,11.43 v70.54,11.43
RESET  (via drill 0.33)
  Top 0.203: PGM.5 76.34,49.34 75.21,48.21 | 75.21,48.21 v61.39,48.21 | v51.64,48.21 51.64,51.3 IC6.4 | 75.21,48.21 75.76,48.21 R21.1
  Bottom 0.203: v61.39,48.21 v51.64,48.21
SID_SUPPLY
  Top 0.203: IC2.28 16.48,67.05 C8.1
  Bottom 0.406: IC2.28 16.48,65.29 17.3,64.46 20.14,64.46 20.95,63.65 20.95,62.3 JP3.2
SIG_IN
  Top 0.203: J_FILTER_IN.P$1 10.84,1.11 11.81,2.08 11.81,8.99 10.39,10.41 R25.1
SIG_OUT
  Top 0.203: R38.2 82.78,10.06 80.7,7.98 80.7,6.88 IC5.7 IC5.6
TX
  Top 0.203: IC6.10 46.73,50.42 46.35,50.04 45.54,50.04 44.93,50.65 40.46,50.65 38.84,52.27 38.84,58.27 TX.2
V_OCT_MAIN
  Top 0.203: IC9.3 64.41,60.02 63.42,61.01 63.42,67.92 64.64,69.14 67.89,69.14 68.5,69.75 IC11.1
  Top 0.305: IC11.1 68.5,75.42 VCO_TRIM.A
V_OCT_SUB
  Top 0.203: IC11.7 67.28,65.94 67.28,64.67 66.67,64.06 66.67,62.03 67.44,61.26 R40.2 67.44,60.35 67.08,59.99 65.25,59.99 65.05,59.79 IC9.2
XTAL1
  Top 0.203: Y2.2 43.27,54.69 C19.2 43.76,54.41 47.88,54.41 48.39,53.9 48.39,51.46 IC6.8
XTAL2
  Top 0.203: Y2.1 52.93,54.8 C20.2 52.43,54.41 49.71,54.41 49.2,53.9 49.2,51.47 IC6.7

### Text on the board
tNames: //// SID GUTS DX \\\\\\\\ / \\\\\\\\ REV005 ////
bNames: U4 | U3